# EAGLE board maple-audio-r1 (EAGLE 5.04)
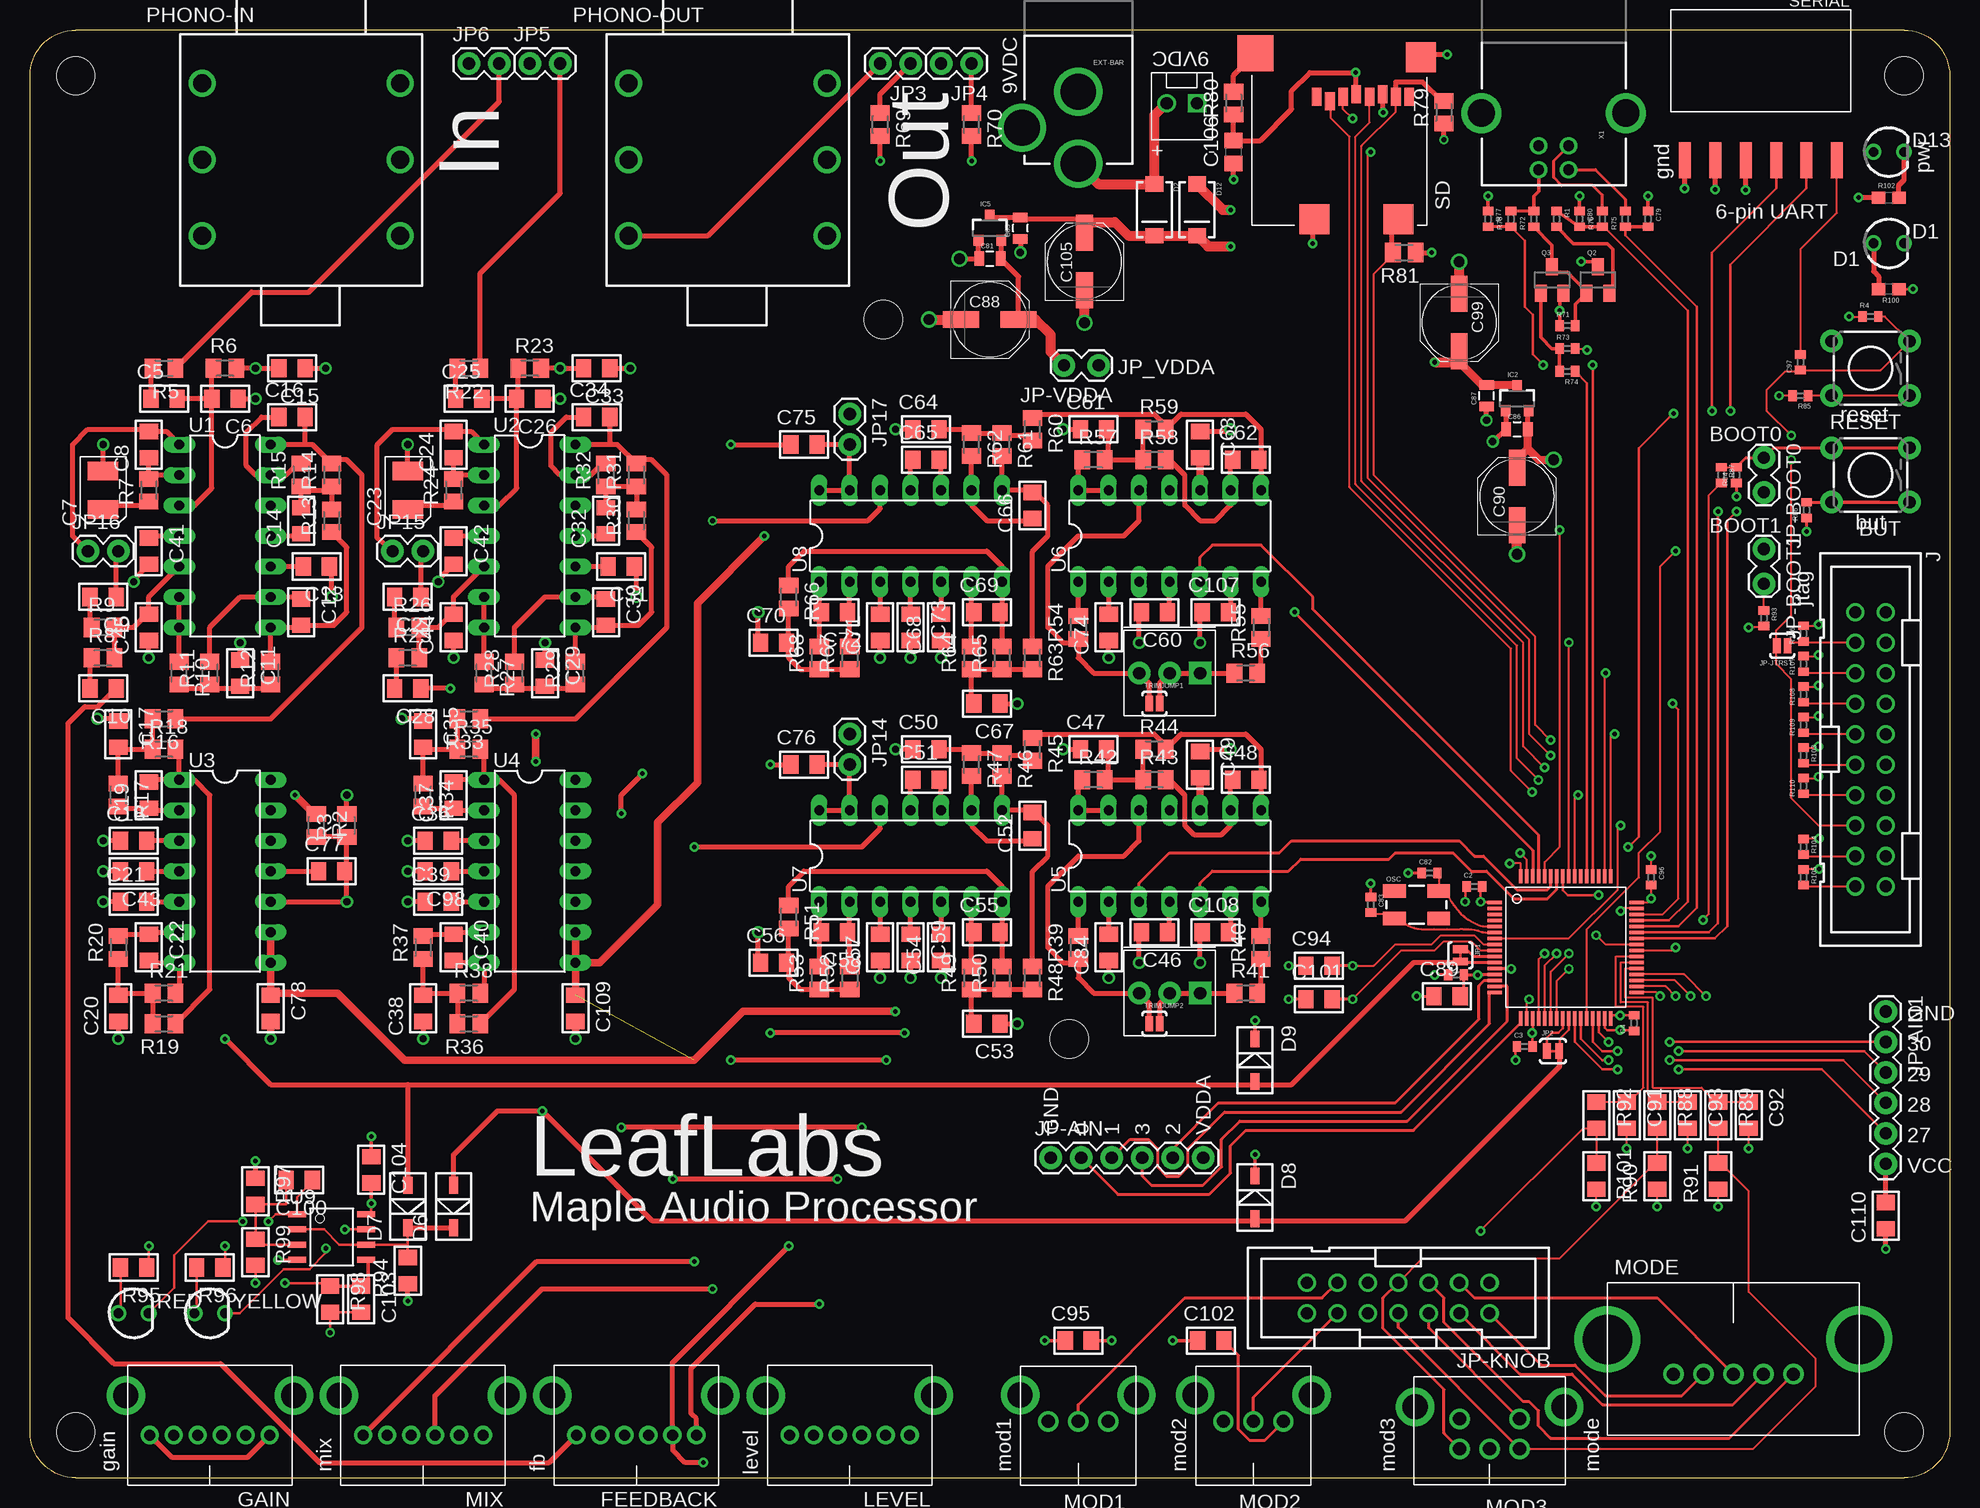
[diagram p4: board, top side]
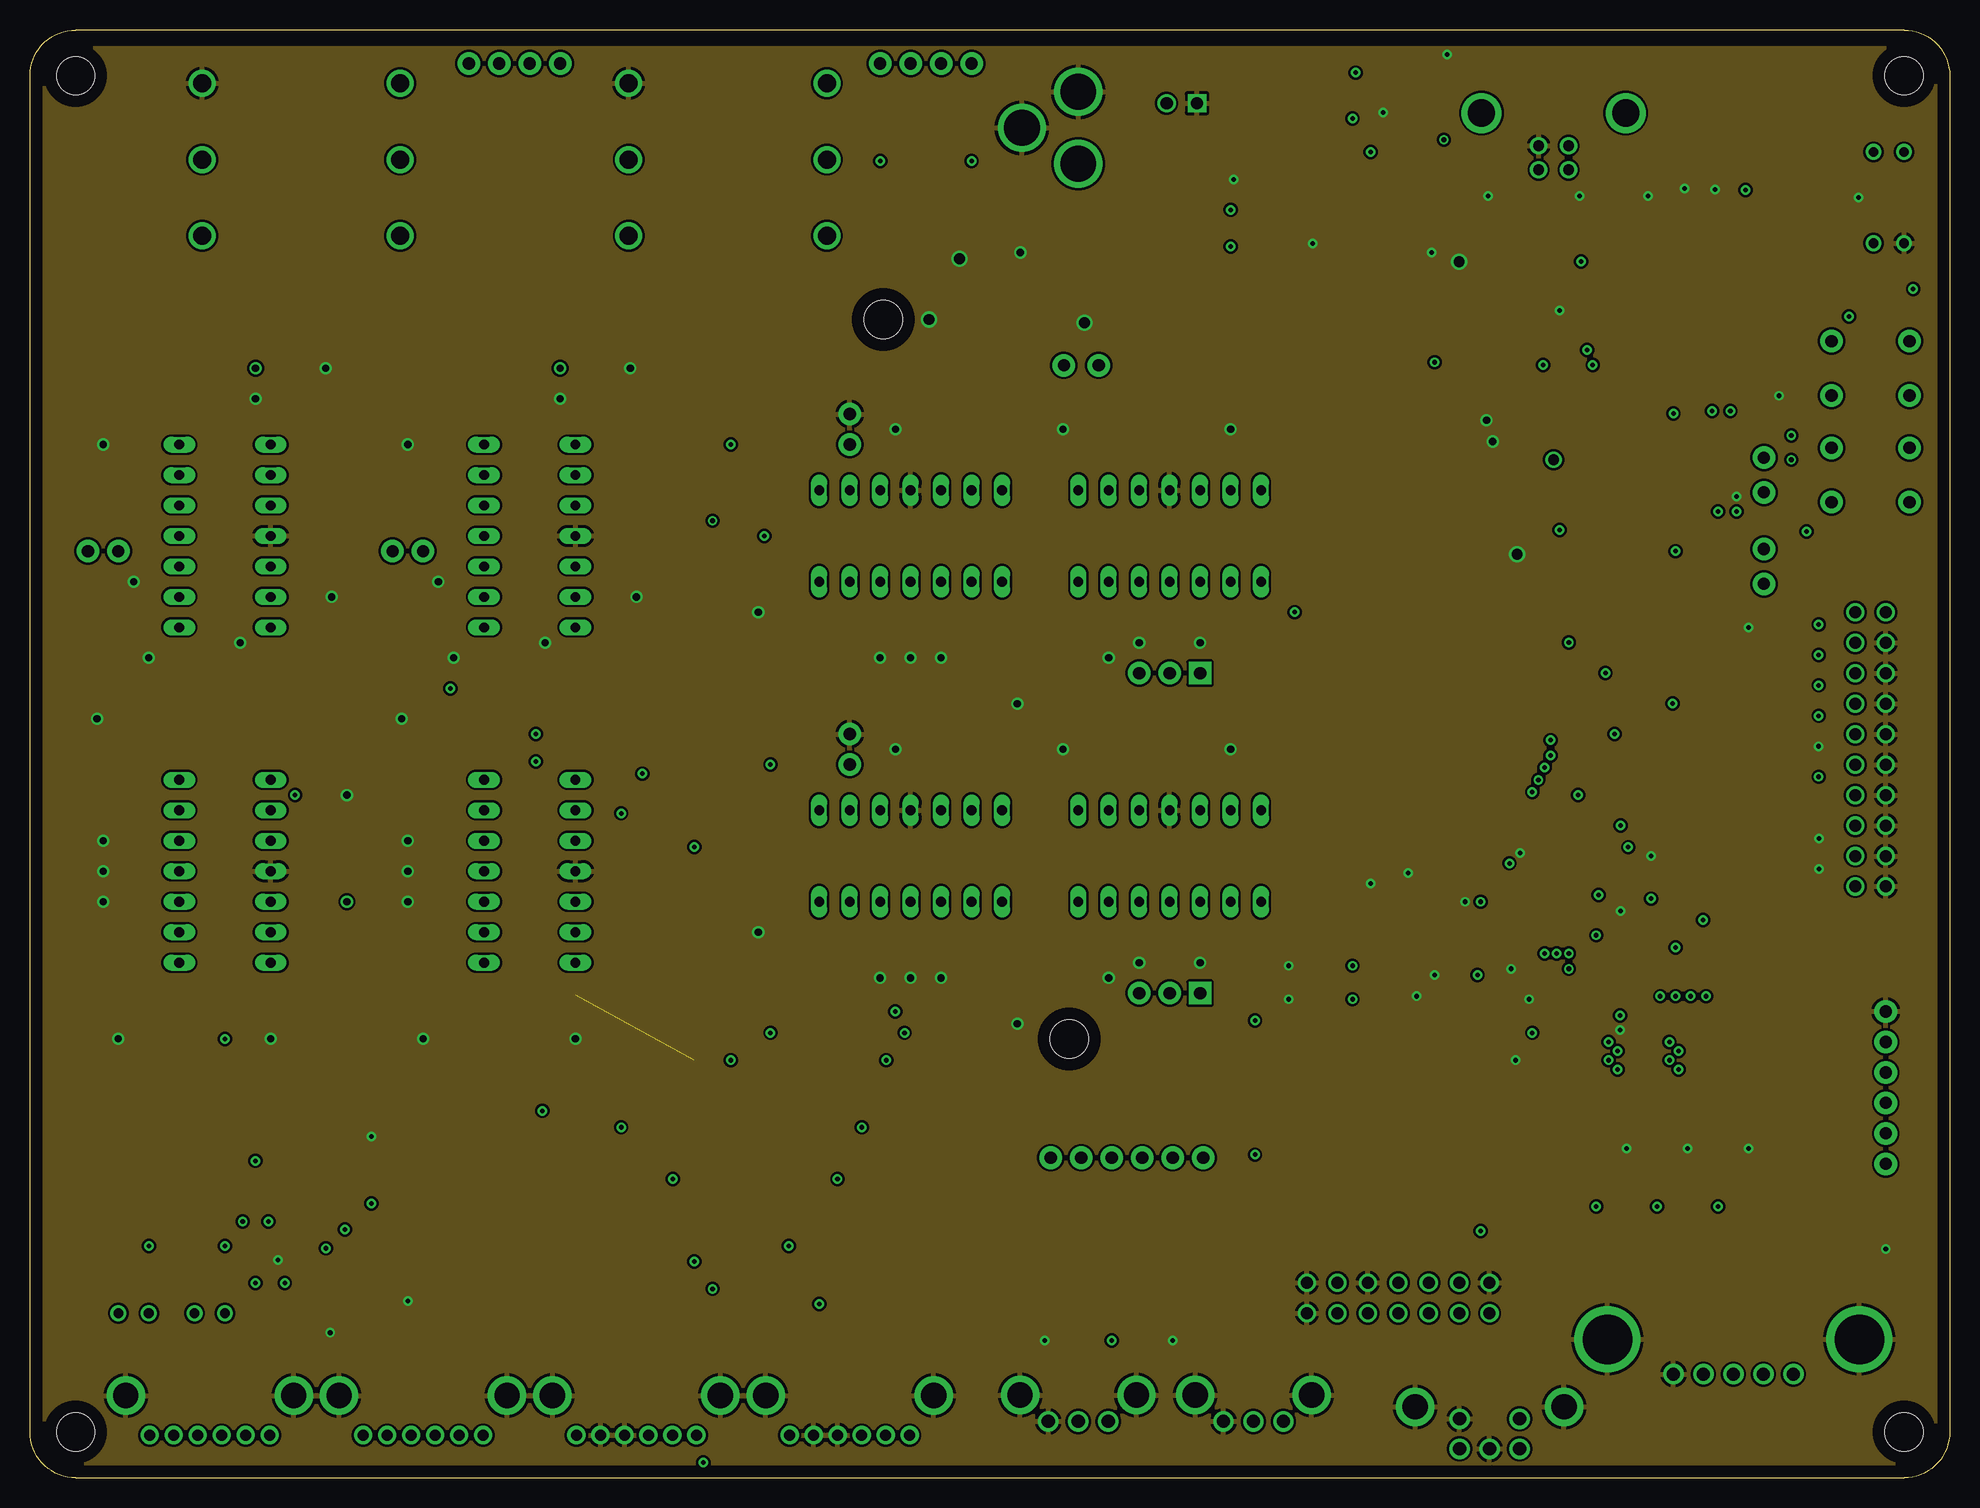
[diagram p5: board, inner layer Route2]
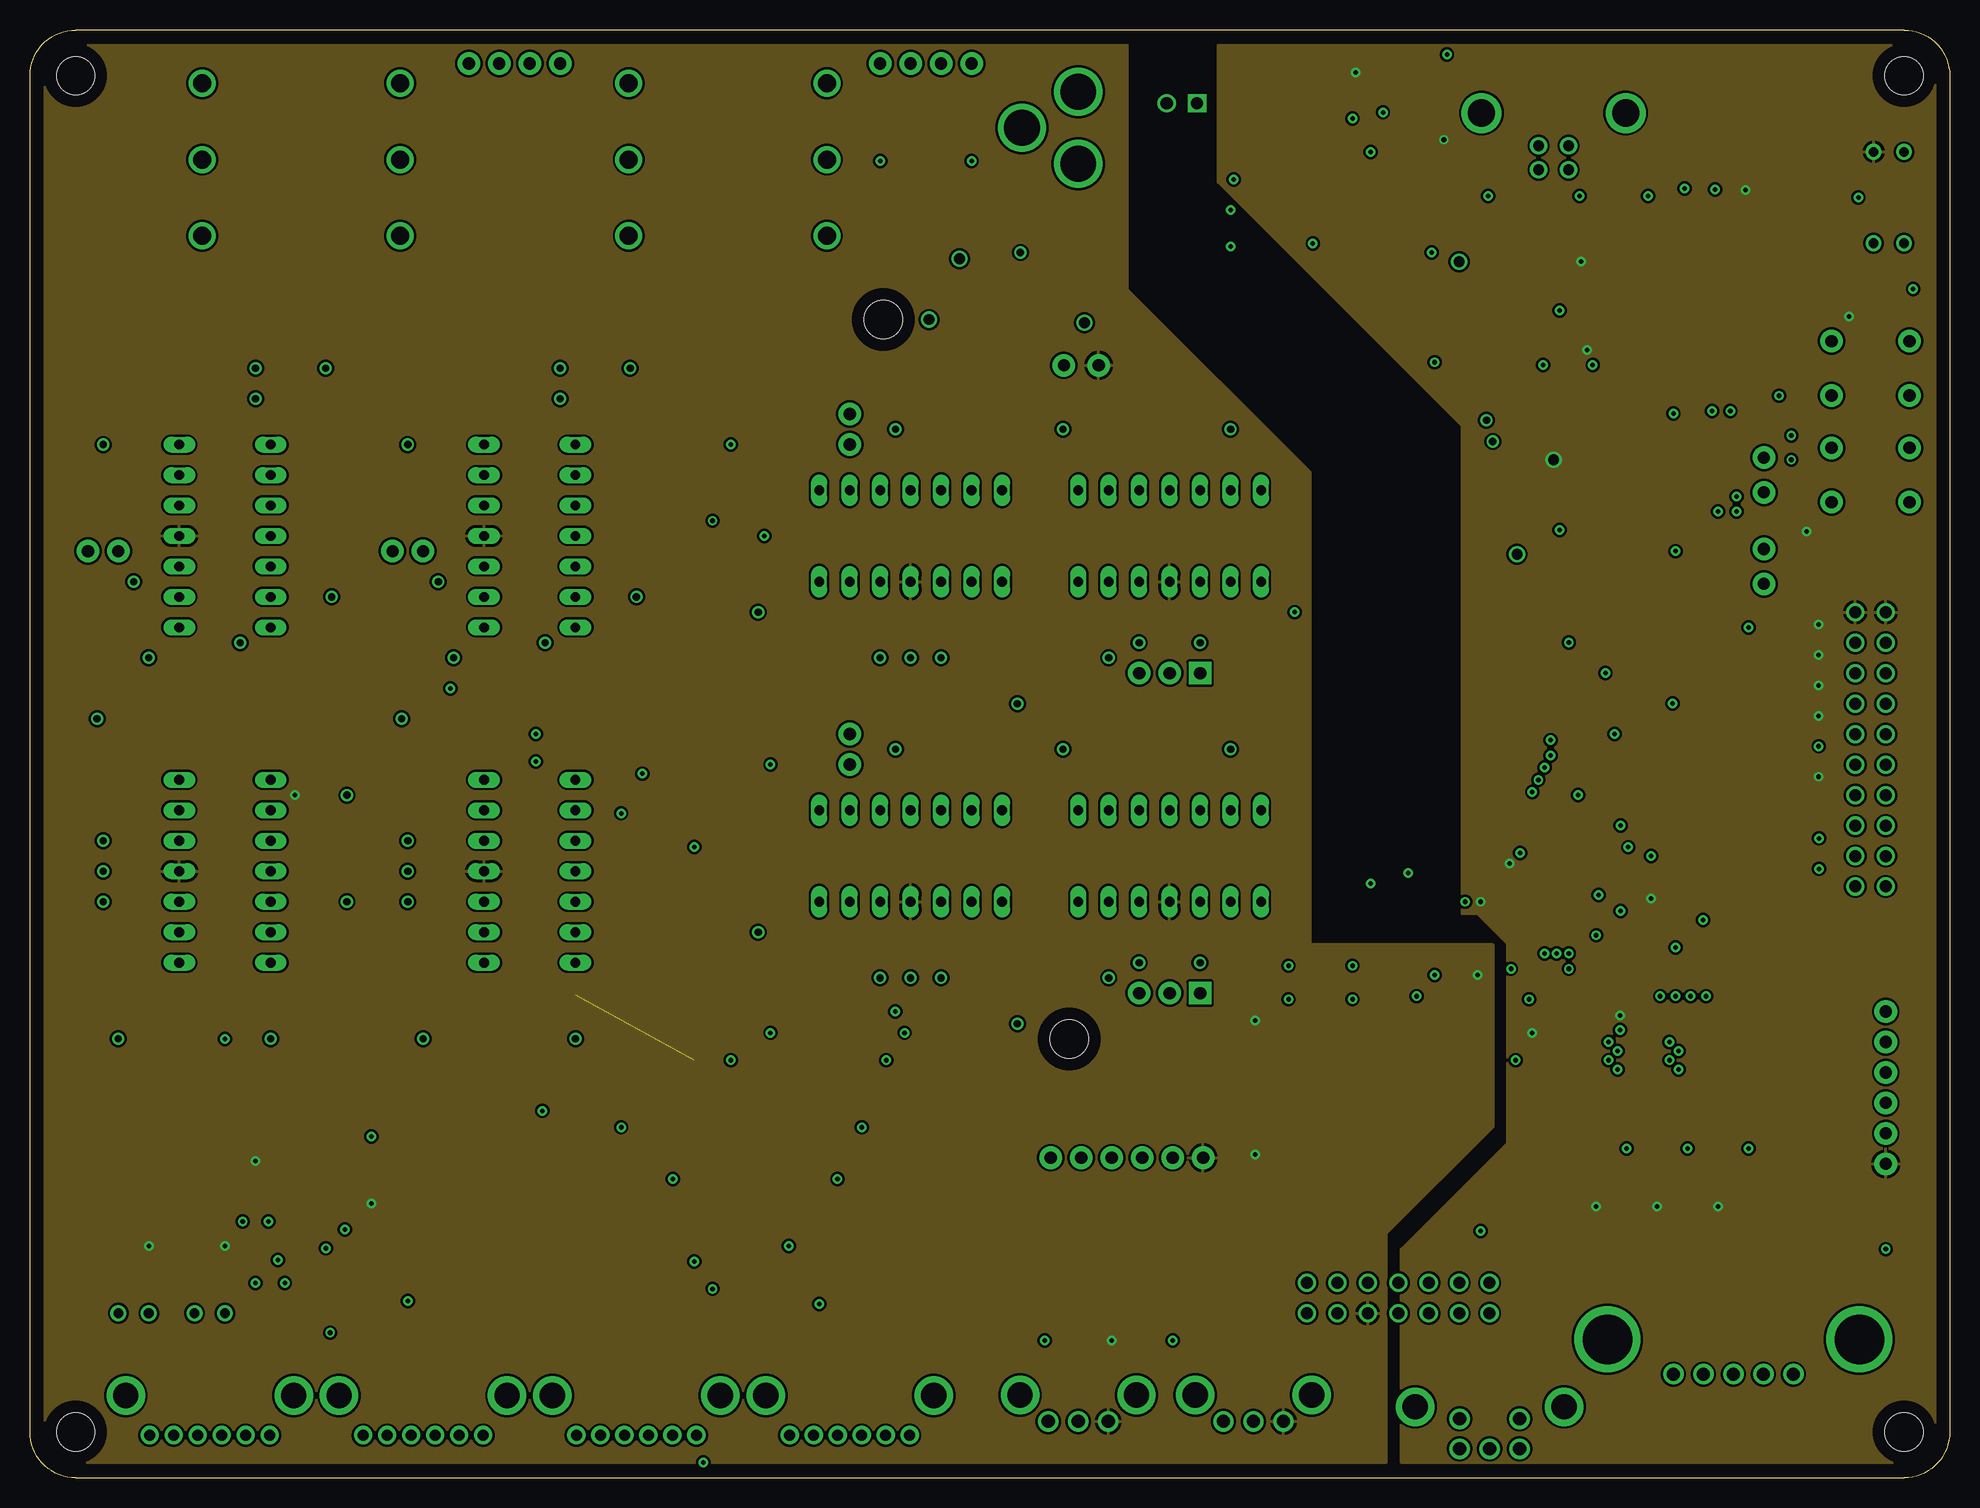
[diagram p6: board, inner layer Route15]
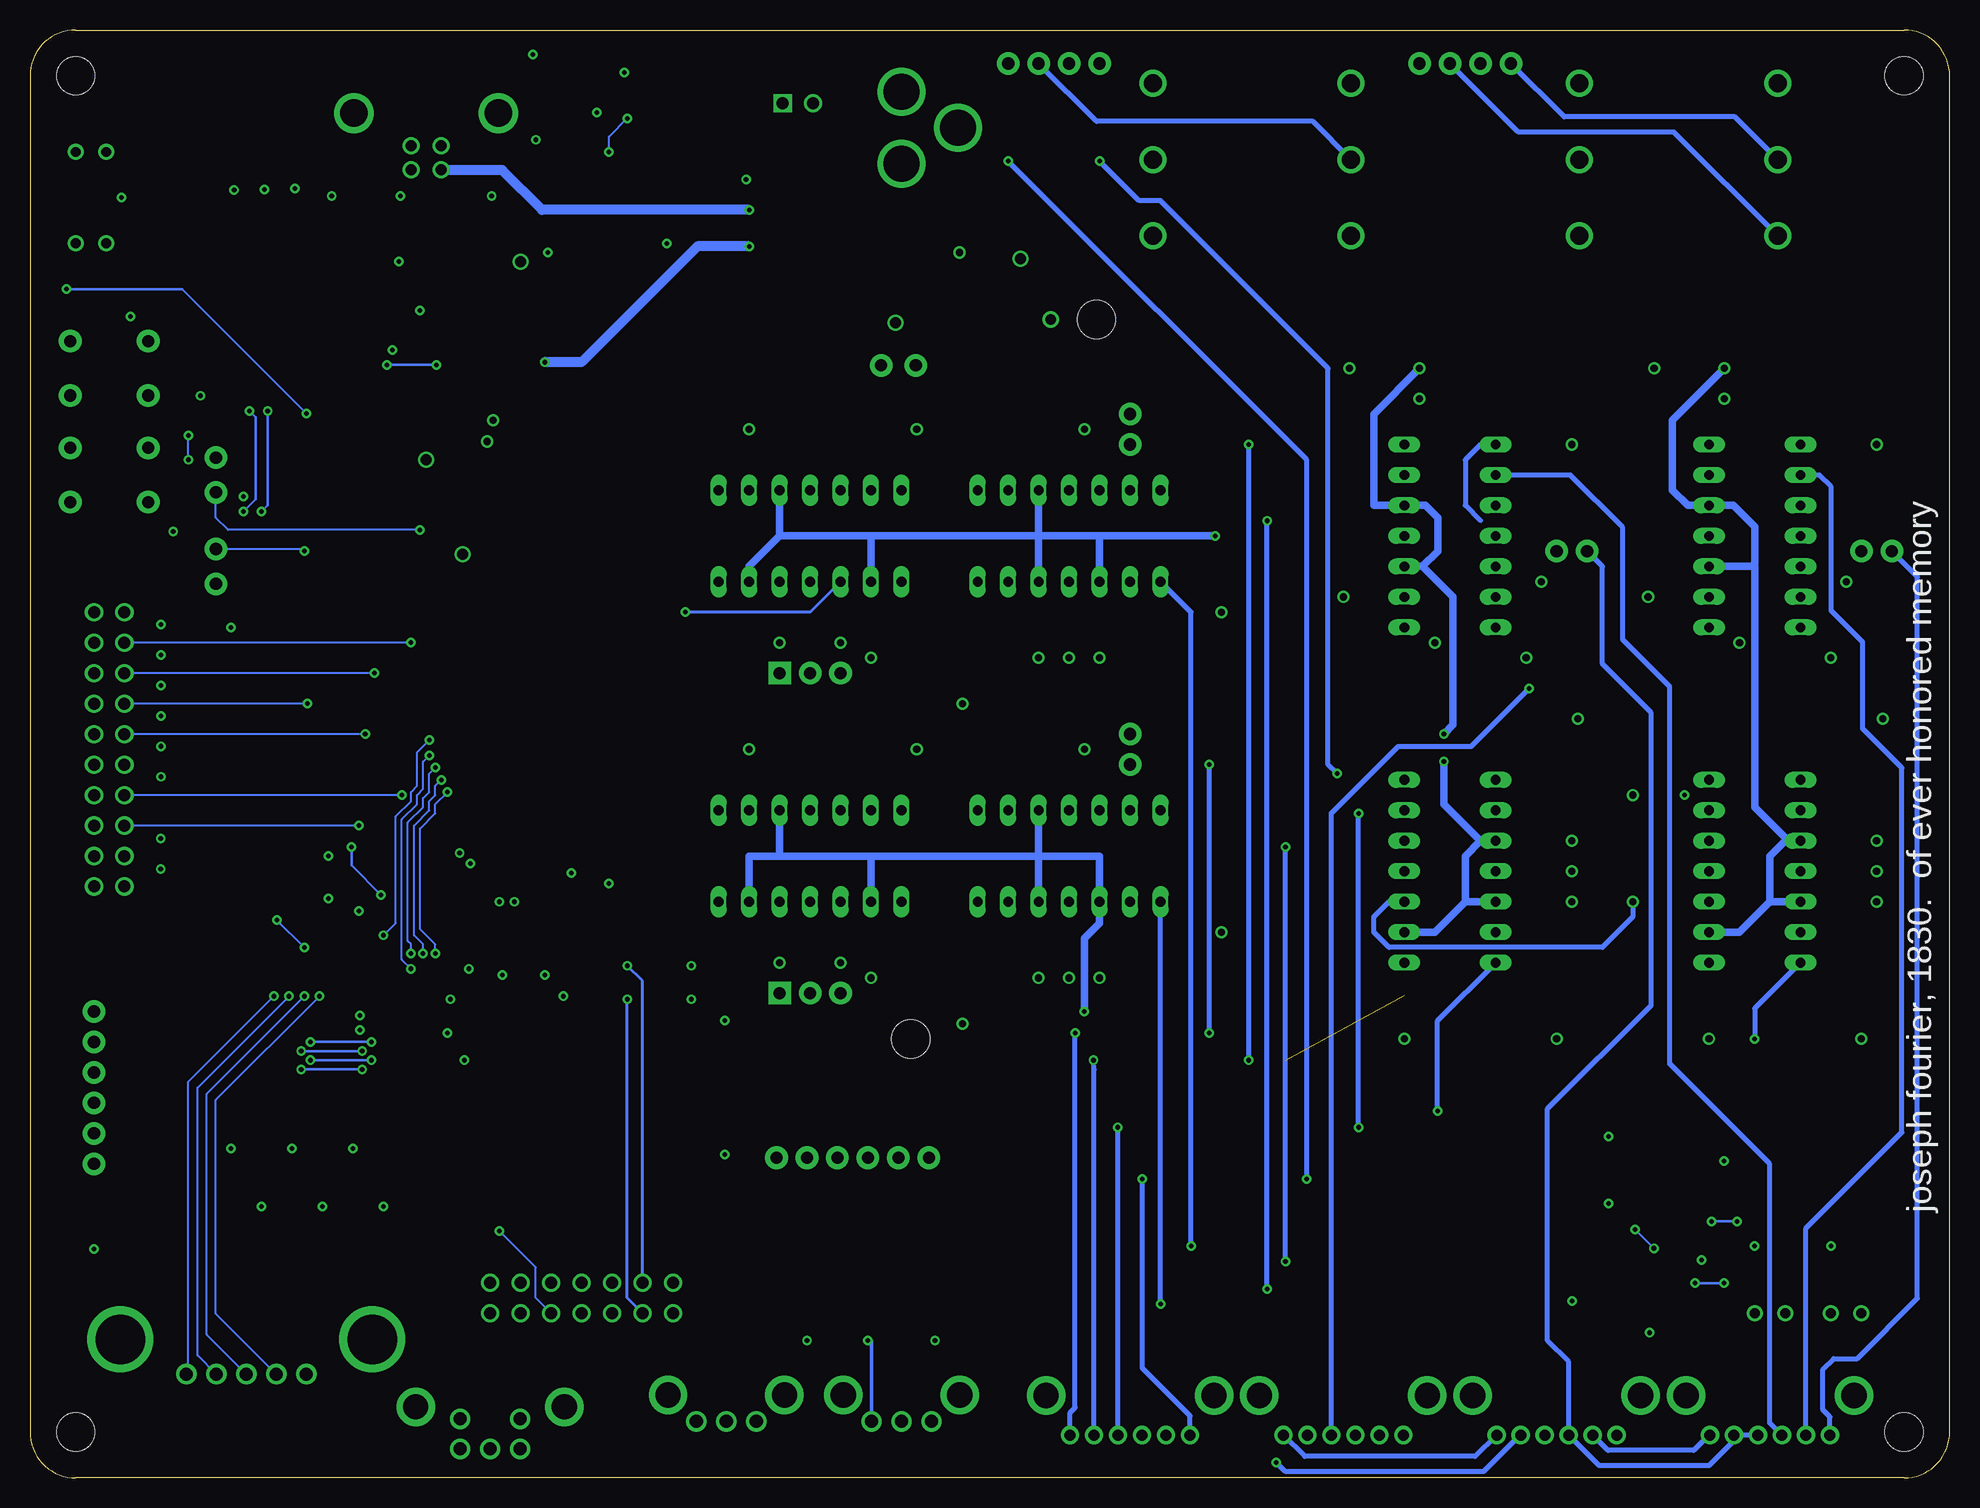
[diagram p7: board, bottom side, seen from below]

Size 160.02 x 120.65 mm. Coordinates in mm from the lower left corner, seen from the top.
Outline: 3.81,0 156.21,0 arc90 160.02,3.81 160.02,116.84 arc90 156.21,120.65 3.81,120.65 arc90 0,116.84 0,3.81 arc90 3.81,0
Copper layers (1*16): Top 0.035mm / dielectric 1.5mm / Bottom 0.035mm
Design rules "default": minimum track width 10mil, minimum drill 24mil, track to track 8mil, track to pad 8mil, pad to pad 8mil, via to via 8mil, smd to smd 8mil, copper to edge 40mil, drill to drill 8mil, minimum pad ring 10mil, minimum via ring 8mil, stop-mask expansion 4mil, vias tented up to drill 0mil, thermal gap 10mil
Net classes: 0 default: width 0.203 mm; 1 power: width 0.203 mm; 2 gnd: width 0.305 mm, drill 0.508 mm, clearance 0.152 mm; 3 usbvcc: width 0.508 mm, drill 0.508 mm, clearance 0.152 mm
Holes 3.17 mm at 3.81,3.81 156.21,3.81 156.21,116.84 3.81,116.84 86.61,36.58 71.12,96.52

## Footprints (pad centres in the part's own frame; a part is rotated, then mirrored left to right if it is on the bottom)
TACTILE-PTH = drill 1.016 pad 1.88 round: 1 -3.251,2.261; 2 3.251,2.261; 3 -3.251,-2.261; 4 3.251,-2.261
C0402 = smd 0.7 x 0.9: 1 -0.65,0; 2 0.65,0
0805A = smd 1.27 x 1.524: + 1.091,0; - -1.091,0
3528-21 = smd 1.524 x 2.54: P$1 -1.6,0; P$2 1.6,0
0805 = smd 0.8 x 1.2: 1 -0.9,0; 2 0.9,0
PANASONIC_D = smd 3 x 1.4: + 2.4,0; - -2.4,0
C0805 = smd 1.3 x 1.5: 1 -0.95,0; 2 0.95,0
LED3MM = drill 0.813 round: A -1.27,0; K 1.27,0
SMA-DIODE = smd 1.27 x 1.47: A -2.15,0; C 2.15,0
SOD-123 = smd 1.397 x 0.762: P$1 -1.778,0; P$2 1.778,0
MOLEX-1X2 = drill 1.016 square: 1 0,0 | drill 1.016 round: 2 2.54,0
POWER_JACK_PTH = drill 2.997 round: GND 0,7.7; GNDBREAK 4.7,10.7; PWR 0,13.7
POT/DUAL/VERT = drill 0.914 pad 1.524 round: P$1 -5,0; P$2 -3,0; P$3 -1,0; P$4 1,0; P$5 3,0; P$6 5,0 | drill 2.108 pad 3.2 round: P$7 -7,-3.3; P$8 7,-3.3
SOT23 = smd 0.8 x 0.9: 1 -0.95,-1; 2 0.95,-1; 3 0,1.1
PAK100/2500-20 = drill 1 pad 1.422 round: 1 -11.43,-1.27; 2 -11.43,1.27; 3 -8.89,-1.27; 4 -8.89,1.27; 5 -6.35,-1.27; 6 -6.35,1.27; 7 -3.81,-1.27; 8 -3.81,1.27; 9 -1.27,-1.27; 10 -1.27,1.27; 11 1.27,-1.27; 12 1.27,1.27; 13 3.81,-1.27; 14 3.81,1.27; 15 6.35,-1.27; 16 6.35,1.27; 17 8.89,-1.27; 18 8.89,1.27; 19 11.43,-1.27; 20 11.43,1.27
SJ_2S-TRACE = smd 0.635 x 1.27: 1 -0.508,0; 2 0.508,0
1X02 = drill 1.016 pad 1.88 round: 1 0,0; 2 2.54,0
1X06 = drill 1.016 pad 1.88 round: 1 0,0; 2 2.54,0; 3 5.08,0; 4 7.62,0; 5 10.16,0; 6 12.7,0
1X02_LOCK = drill 1.016 pad 1.88 round: 1 -0.178,0; 2 2.718,0
SJ_2S-NO = smd 0.635 x 1.27: 1 -0.45,0; 2 0.45,0
PAK100/2500-14 = drill 1 pad 1.422 round: 1 -7.62,-1.27; 2 -7.62,1.27; 3 -5.08,-1.27; 4 -5.08,1.27; 5 -2.54,-1.27; 6 -2.54,1.27; 7 0,-1.27; 8 0,1.27; 9 2.54,-1.27; 10 2.54,1.27; 11 5.08,-1.27; 12 5.08,1.27; 13 7.62,-1.27; 14 7.62,1.27
POT/SINGLE/PANASONIC = drill 1.092 pad 1.7 round: P$1 0,0; P$2 2.5,0; P$3 -2.5,0 | drill 2.108 pad 3.2 round: P$4 -4.85,-2.2; P$5 4.85,-2.2
ROTARY-ENCODER = drill 1.092 pad 1.7 round: P$1 0,0; P$2 -2.5,0; P$3 2.5,0; P$4 2.5,-2.5; P$5 -2.5,-2.5 | drill 2.108 pad 3.2 round: P$6 -6.2,-3.5; P$7 6.2,-3.5
ROTARY-ENCODER/BINARY = drill 1.092 pad 1.7 round: P$1 5,0; P$2 2.5,0; P$3 0,0; P$4 -2.5,0; P$5 -5,0 | drill 4.115 pad 5.5 round: P$6 -10.5,2.9; P$7 10.5,2.9
CRYSTAL-SMD-5X3 = smd 1.9 x 1.1: 1 -1.85,-1.15; 2 1.85,-1.15; 3 1.85,1.15; 4 -1.85,1.15
3362U = drill 1.016 pad 1.88 square: P$1 0,2.54 | drill 1.016 pad 1.88 round: P$2 2.54,2.54; P$3 5.08,2.54
1/4"JACK/STEREO = drill 1.499 round: P$1 -8.255,-4.191; P$2 -8.255,-10.541; P$3 -8.255,-16.891; P$4 8.255,-16.891; P$5 8.255,-10.541; P$6 8.255,-4.191
SOT23' = smd 1 x 1.4: 1 -0.95,-1.1; 2 0.95,-1.1; 3 0,1.1
M0805 = smd 1.3 x 1.6: 1 -0.95,0; 2 0.95,0
0603 = smd 1.1 x 1: 1 -0.85,0; 2 0.85,0
3MMICROSD = smd 0.8 x 1.5: P$1 5.4,10.7; P$2 6.5,10.3; P$3 7.6,10.7; P$4 8.7,10.9; P$5 9.8,10.7; P$6 10.9,10.9; P$7 12,10.7; P$8 13.1,10.7 | smd 3 x 3: P$9 0.3,14.3 | smd 2.5 x 2.5: P$10 12.2,0.5; P$11 5.2,0.5; P$12 14.1,14
1X06-SMD-FEMALE-V2 = smd 1 x 3: 1 6.35,4.5; 2 3.81,4.5; 3 1.27,4.5; 4 -1.27,4.5; 5 -3.81,4.5; 6 -6.35,4.5
14-PDIP = drill 0.813 long: 1 -7.62,-3.81; 2 -5.08,-3.81; 3 -2.54,-3.81; 4 0,-3.81; 5 2.54,-3.81; 6 5.08,-3.81; 7 7.62,-3.81; 8 7.62,3.81; 9 5.08,3.81; 10 2.54,3.81; 11 0,3.81; 12 -2.54,3.81; 13 -5.08,3.81; 14 -7.62,3.81
8-SOIC = smd 1.524 x 0.508: 1 -2.87,1.905; 2 -2.87,0.635; 3 -2.87,-0.635; 4 -2.87,-1.905; 5 2.87,-1.905; 6 2.87,-0.635; 7 2.87,0.635; 8 2.87,1.905
TQFP-10X10-64 = smd 1.2 x 0.3: P$1 -5.936,3.75; P$2 -5.936,3.25; P$3 -5.936,2.75; P$4 -5.936,2.25; P$5 -5.936,1.75; P$6 -5.936,1.25; P$7 -5.936,0.75; P$8 -5.936,0.25; P$9 -5.936,-0.25; P$10 -5.936,-0.75; P$11 -5.936,-1.25; P$12 -5.936,-1.75; P$13 -5.936,-2.25; P$14 -5.936,-2.75; P$15 -5.936,-3.25; P$16 -5.936,-3.75; P$33 5.886,-3.75; P$34 5.886,-3.25; P$35 5.886,-2.75; P$36 5.886,-2.25; P$37 5.886,-1.75; P$38 5.886,-1.25; P$39 5.886,-0.75; P$40 5.886,-0.25; P$41 5.886,0.25; P$42 5.886,0.75; P$43 5.886,1.25; P$44 5.886,1.75; P$45 5.886,2.25; P$46 5.886,2.75; P$47 5.886,3.25; P$48 5.886,3.75 | smd 0.3 x 1.2: P$17 -3.75,-5.911; P$18 -3.25,-5.911; P$19 -2.75,-5.911; P$20 -2.25,-5.911; P$21 -1.75,-5.911; P$22 -1.25,-5.911; P$23 -0.75,-5.911; P$24 -0.25,-5.911; P$25 0.25,-5.911; P$26 0.75,-5.911; P$27 1.25,-5.911; P$28 1.75,-5.911; P$29 2.25,-5.911; P$30 2.75,-5.911; P$31 3.25,-5.911; P$32 3.75,-5.911; P$49 3.75,5.936; P$50 3.25,5.936; P$51 2.75,5.936; P$52 2.25,5.936; P$53 1.75,5.936; P$54 1.25,5.936; P$55 0.75,5.936; P$56 0.25,5.936; P$57 -0.25,5.936; P$58 -0.75,5.936; P$59 -1.25,5.936; P$60 -1.75,5.936; P$61 -2.25,5.936; P$62 -2.75,5.936; P$63 -3.25,5.936; P$64 -3.75,5.936
USB-B-PTH = drill 0.914 round: D+ 0,1.25; D- 1.981,1.25; GND 0,-1.25; VBUS 1.981,-1.25 | drill 2.286 round: P$1 -2.718,-6.02; P$2 -2.718,6.02

## Placement (x,y rotation side)
BUT  [TACTILE-PTH]  153.42,83.57 180 top
C1  0.1uF  [C0402]  118.87,41.91 0 top
C2  1uF  [C0402]  120.4,49.28 0 top
C3  1uF  [C0402]  124.59,35.94 0 top
C4  1uF  [C0402]  133.71,37.9 90 top
C5  0.1uF  [0805A]  11.18,89.92 0 top
C6  220pF  [0805A]  16.26,89.92 180 top
C7  100uF  [3528-21]  6.1,82.3 90 top
C8  100pF  [0805A]  9.91,86.11 90 top
C9  10uF  [0805A]  6.1,73.41 180 top
C10  10uF  [0805A]  6.1,65.79 180 top
C11  2.2nF  [0805A]  17.53,67.06 270 top
C12  1nF  [0805A]  22.61,72.14 270 top
C13  1uF  [0805A]  23.88,75.95 180 top
C14  3.3nF  [0805A]  22.61,79.76 90 top
C15  1uF  [0805A]  21.84,92.46 180 top
C16  1nF  [0805A]  21.84,88.39 0 top
C17  6.8nF  [0805A]  7.37,61.98 270 top
C18  1uF  [0805A]  8.64,53.09 0 top
C19  1nF  [0805A]  9.91,56.9 90 top
C20  47nF  [0805A]  7.37,39.12 90 top
C21  1uF  [0805A]  8.64,48.01 0 top
C22  1nF  [0805A]  9.91,44.2 270 top
C23  100uF  [3528-21]  31.5,82.3 90 top
C24  100pF  [0805A]  35.31,86.11 90 top
C25  0.1uF  [0805A]  36.58,89.92 0 top
C26  220pF  [0805A]  41.66,89.92 180 top
C27  10uF  [0805A]  31.5,73.41 180 top
C28  10uF  [0805A]  31.5,65.79 180 top
C29  2.2nF  [0805A]  42.93,67.06 270 top
C30  1nF  [0805A]  48.01,72.14 270 top
C31  1uF  [0805A]  49.28,75.95 180 top
C32  3.3nF  [0805A]  48.01,79.76 90 top
C33  1uF  [0805A]  47.24,92.46 180 top
C34  1nF  [0805A]  47.24,88.39 0 top
C35  6.8nF  [0805A]  32.77,61.98 270 top
C36  1uF  [0805A]  34.04,53.09 0 top
C37  1nF  [0805A]  35.31,56.9 90 top
C38  47nF  [0805A]  32.77,39.12 90 top
C39  1uF  [0805A]  34.04,48.01 0 top
C40  1nF  [0805A]  35.31,44.2 270 top
C41  10uF  [0805A]  9.91,77.22 270 top
C42  10uF  [0805A]  35.31,77.22 270 top
C43  10uF  [0805A]  8.64,50.55 180 top
C44  220pF  [0805A]  35.31,70.87 90 top
C45  220pF  [0805A]  9.91,70.87 90 top
C46  10uF  [0805A]  93.73,45.47 180 top
C47  2.2nF  [0805A]  88.65,60.71 0 top
C48  1nF  [0805A]  101.35,58.17 0 top
C49  1uF  [0805A]  97.54,59.44 270 top
C50  3.3nF  [0805A]  74.68,60.71 0 top
C51  1uF  [0805A]  74.68,58.17 0 top
C52  1nF  [0805A]  83.57,54.36 90 top
C53  6.8nF  [0805A]  79.76,37.85 180 top
C54  1uF  [0805A]  75.95,44.2 90 top
C55  1nF  [0805A]  79.76,45.47 0 top
C56  47nF  [0805A]  61.98,42.93 0 top
C57  1uF  [0805A]  70.87,44.2 90 top
C58  1nF  [0805A]  67.06,45.47 180 top
C59  10uF  [0805A]  73.41,44.2 270 top
C60  10uF  [0805A]  93.73,72.14 180 top
C61  2.2nF  [0805A]  88.65,87.38 0 top
C62  1nF  [0805A]  101.35,84.84 0 top
C63  1uF  [0805A]  97.54,86.11 270 top
C64  3.3nF  [0805A]  74.68,87.38 0 top
C65  1uF  [0805A]  74.68,84.84 0 top
C66  1nF  [0805A]  83.57,81.03 90 top
C67  6.8nF  [0805A]  79.76,64.52 180 top
C68  1uF  [0805A]  75.95,70.87 90 top
C69  1nF  [0805A]  79.76,72.14 0 top
C70  47nF  [0805A]  61.98,69.6 0 top
C71  1uF  [0805A]  70.87,70.87 90 top
C72  1nF  [0805A]  67.06,72.14 180 top
C73  10uF  [0805A]  73.41,70.87 270 top
C74  1uF  [0805A]  89.92,70.87 90 top
C75  10uF  [0805A]  64.52,86.11 0 top
C76  10uF  [0805A]  64.52,59.44 0 top
C77  10uF  [0805A]  25.15,50.55 0 top
C78  10uF  [0805A]  20.07,39.12 270 top
C79  47pF  [C0402]  134.87,104.9 270 top
C80  47pF  [C0402]  129.16,104.9 270 top
C81  1uF  [0805]  80.01,101.6 0 top
C82  33pF  [C0402]  116.66,50.39 0 top
C83  33pF  [C0402]  111.76,47.75 270 top
C84  1uF  [0805A]  89.92,44.2 90 top
C85  1uF  [0805]  82.55,104.14 90 top
C86  1uF  [0805]  123.95,87.38 0 top
C87  1uF  [0805]  121.41,90.17 90 top
C88  100uF  [PANASONIC_D]  80.01,96.52 0 top
C89  10uF  [0805A]  118.11,40.13 0 top
C90  100uF  [PANASONIC_D]  123.95,81.79 90 top
C91  0.1uF  [0805A]  133.1,30.23 270 top
C92  0.01uF  [0805A]  143.26,30.23 270 top
C93  0.01uF  [0805A]  138.18,30.23 270 top
C94  0.1uF  [0805A]  107.44,42.67 0 top
C95  0.1uF  [0805A]  87.38,11.43 0 top
C96  1uF  [C0402]  135.13,50.04 270 top
C97  0.1uF  [C0402]  147.57,92.96 90 top
C98  10uF  [0805A]  34.04,50.55 180 top
C99  100uF  [PANASONIC_D]  119.13,96.27 270 top
C100  0.1uF  [0805A]  22.45,24.82 180 top
C101  0.1uF  [0805A]  107.44,39.88 0 top
C102  0.1uF  [0805A]  98.42,11.43 0 top
C103  0.1uF  [0805A]  27.61,14.88 270 top
C104  0.1uF  [0805A]  28.45,25.65 270 top
C105  100uF  [PANASONIC_D]  87.88,101.35 90 top
C106  10uF  [C0805]  100.33,110.49 90 top
C107  1uF  [0805A]  98.81,72.14 0 top
C108  1uF  [0805A]  98.81,45.47 0 top
C109  10uF  [0805A]  45.47,39.12 270 top
C110  10uF  [0805A]  154.69,21.84 90 top
D1  Blue  [LED3MM]  154.94,102.87 0 top
D2  [SMA-DIODE]  93.73,105.66 270 top
D6  1N4148  [SOD-123]  35.31,22.61 90 top
D7  1N4148  [SOD-123]  31.5,22.61 90 top
D8  1N4148  [SOD-123]  102.11,23.37 270 top
D9  1N4148  [SOD-123]  102.11,34.8 270 top
D12  [SMA-DIODE]  97.28,105.66 270 top
D13  Green  [LED3MM]  154.94,110.49 0 top
EXT  [MOLEX-1X2]  97.28,114.55 180 top
EXT-BAR  POWER_JACKPTH  [POWER_JACK_PTH]  87.38,123.19 180 top
FEEDBACK  10kB  [POT/DUAL/VERT]  50.55,3.56 180 top
GAIN  50kA  [POT/DUAL/VERT]  14.99,3.56 180 top
IC2  MCP1703T-3302E/CB  [SOT23]  123.95,89.92 0 top
IC5  MCP1703T-5002E/CB  [SOT23]  80.01,104.14 0 top
J  JTAG  [PAK100/2500-20]  153.42,60.71 270 top
JP1  SOLDERJUMPERTRACE  [SJ_2S-TRACE]  119.23,43.54 270 top
JP2  SOLDERJUMPERTRACE  [SJ_2S-TRACE]  126.95,35.56 0 top
JP3  [1X02]  73.41,117.86 180 top
JP4  [1X02]  78.49,117.86 180 top
JP5  [1X02]  41.66,117.86 0 top
JP6  [1X02]  36.58,117.86 0 top
JP14  [1X02]  68.33,61.98 270 top
JP15  [1X02]  30.23,77.22 0 top
JP16  [1X02]  4.83,77.22 0 top
JP17  [1X02]  68.33,88.65 270 top
JP-AIN  [1X06]  85.09,26.67 0 top
JP-AIN1  [1X06]  154.69,38.86 270 top
JP-BOOT0  [1X02_LOCK]  144.53,84.84 270 top
JP-BOOT1  [1X02_LOCK]  144.53,77.22 270 top
JP-JTRST  SOLDERJUMPERNO  [SJ_2S-NO]  146.05,69.34 180 top
JP-KNOB  JP-KNOB  [PAK100/2500-14]  114.05,14.99 180 top
JP-VDDA  [1X02_LOCK]  88.9,92.71 180 top
LEVEL  10kA  [POT/DUAL/VERT]  68.33,3.56 180 top
MIX  50kB  [POT/DUAL/VERT]  32.77,3.56 180 top
MOD1  10kB  [POT/SINGLE/PANASONIC]  87.38,4.7 180 top
MOD2  10kB  [POT/SINGLE/PANASONIC]  101.98,4.7 180 top
MOD3  MOD3  [ROTARY-ENCODER]  121.67,2.41 180 top
MODE  MODE  [ROTARY-ENCODER/BINARY]  141.99,8.64 0 top
OSC  8MHz  [CRYSTAL-SMD-5X3]  115.57,47.75 0 top
OTRIM1  [3362U]  97.54,69.6 180 top
OTRIM2  [3362U]  97.54,42.93 180 top
PHONO-IN  IN  [1/4"JACK/STEREO]  22.61,120.4 0 top
PHONO-OUT  IN  [1/4"JACK/STEREO]  58.17,120.4 0 top
Q2  [SOT23']  130.68,99.82 0 top
Q3  [SOT23']  126.87,99.82 0 top
R1  1.5k  [C0402]  127.25,104.9 270 top
R2  10k  [M0805]  23.88,54.36 270 top
R3  10k  [M0805]  26.42,54.36 90 top
R4  10k  [C0402]  153.42,96.77 0 top
R5  10k  [M0805]  11.18,92.46 180 top
R6  100k  [M0805]  16.26,92.46 0 top
R7  1k  [M0805]  9.91,82.3 90 top
R8  33k  [M0805]  6.1,68.33 0 top
R9  33k  [M0805]  6.1,70.87 0 top
R10  6.2k  [M0805]  12.45,67.06 270 top
R11  4.7k  [M0805]  14.99,67.06 90 top
R12  6.2k  [M0805]  20.07,67.06 90 top
R13  4.3k  [M0805]  25.15,79.76 90 top
R14  4.3k  [M0805]  25.15,83.57 90 top
R15  4.3k  [M0805]  22.61,83.57 90 top
R16  3.6k  [M0805]  11.18,63.25 180 top
R17  2.7k  [M0805]  7.37,56.9 270 top
R18  3.6k  [M0805]  11.18,60.71 0 top
R19  1.6k  [M0805]  11.18,37.85 180 top
R20  820  [M0805]  7.37,44.2 90 top
R21  1.6k  [M0805]  11.18,40.39 0 top
R22  10k  [M0805]  36.58,92.46 180 top
R23  100k  [M0805]  41.66,92.46 0 top
R24  1k  [M0805]  35.31,82.3 90 top
R25  33k  [M0805]  31.5,68.33 0 top
R26  33k  [M0805]  31.5,70.87 0 top
R27  6.2k  [M0805]  37.85,67.06 270 top
R28  4.7k  [M0805]  40.39,67.06 90 top
R29  6.2k  [M0805]  45.47,67.06 90 top
R30  4.3k  [M0805]  50.55,79.76 90 top
R31  4.3k  [M0805]  50.55,83.57 90 top
R32  4.3k  [M0805]  48.01,83.57 90 top
R33  3.6k  [M0805]  36.58,63.25 180 top
R34  2.7k  [M0805]  32.77,56.9 270 top
R35  3.6k  [M0805]  36.58,60.71 0 top
R36  1.6k  [M0805]  36.58,37.85 180 top
R37  820  [M0805]  32.77,44.2 90 top
R38  1.6k  [M0805]  36.58,40.39 0 top
R39  100  [M0805]  87.38,44.2 90 top
R40  25.5k  [M0805]  102.62,44.2 90 top
R41  100  [M0805]  101.35,40.39 0 top
R42  6.2k  [M0805]  88.65,58.17 0 top
R43  4.7k  [M0805]  93.73,58.17 0 top
R44  6.2k  [M0805]  93.73,60.71 0 top
R45  4.3k  [M0805]  83.57,60.71 270 top
R46  4.3k  [M0805]  81.03,59.44 270 top
R47  4.3k  [M0805]  78.49,59.44 270 top
R48  3.6k  [M0805]  83.57,41.66 270 top
R49  2.7k  [M0805]  78.49,41.66 90 top
R50  3.6k  [M0805]  81.03,41.66 90 top
R51  1.6k  [M0805]  63.25,46.74 270 top
R52  820  [M0805]  68.33,41.66 90 top
R53  1.6k  [M0805]  65.79,41.66 90 top
R54  100  [M0805]  87.38,70.87 90 top
R55  25.5k  [M0805]  102.62,70.87 90 top
R56  100  [M0805]  101.35,67.06 0 top
R57  6.2k  [M0805]  88.65,84.84 0 top
R58  4.7k  [M0805]  93.73,84.84 0 top
R59  6.2k  [M0805]  93.73,87.38 0 top
R60  4.3k  [M0805]  83.57,87.38 270 top
R61  4.3k  [M0805]  81.03,86.11 270 top
R62  4.3k  [M0805]  78.49,86.11 270 top
R63  3.6k  [M0805]  83.57,68.33 270 top
R64  2.7k  [M0805]  78.49,68.33 90 top
R65  3.6k  [M0805]  81.03,68.33 90 top
R66  1.6k  [M0805]  63.25,73.41 270 top
R67  820  [M0805]  68.33,68.33 90 top
R68  1.6k  [M0805]  65.79,68.33 90 top
R69  10k  [M0805]  70.87,112.78 270 top
R70  10k  [M0805]  78.49,112.78 270 top
R71  36k  [C0402]  128.14,96.01 0 top
R72  10k  [C0402]  125.35,104.9 90 top
R73  47k  [C0402]  128.14,94.11 0 top
R74  1k  [C0402]  128.14,92.2 180 top
R75  22  [C0402]  132.97,104.9 90 top
R76  22  [C0402]  131.06,104.9 90 top
R77  1.5k  [C0402]  121.54,104.9 270 top
R78  1.5k  [C0402]  123.44,104.9 90 top
R79  10k  [M0805]  117.86,113.79 90 top
R80  2k  [M0805]  100.33,114.55 90 top
R81  33k  [M0805]  114.55,102.11 180 top
R84  10k  [C0402]  142.24,83.57 90 top
R85  1k  [C0402]  147.57,90.17 180 top
R86  1k  [C0402]  148.08,80.64 90 top
R87  1k  [C0402]  140.97,83.57 270 top
R88  10k  [0805A]  135.64,30.23 270 top
R89  10k  [0805A]  140.72,30.23 270 top
R90  10k  [0805A]  135.64,25.15 90 top
R91  10k  [0805A]  140.72,25.15 90 top
R92  1k  [0805A]  130.56,30.23 270 top
R93  10k  [C0402]  144.53,71.63 270 top
R94  510k  [0805A]  31.5,17.27 90 top
R95  1k  [0805A]  8.64,17.53 180 top
R96  1k  [0805A]  14.99,17.53 180 top
R97  348k  [0805A]  18.8,23.88 270 top
R98  510k  [0805A]  25.02,14.88 270 top
R99  348k  [0805A]  18.8,18.8 270 top
R100  1k  [0603]  154.94,99.06 180 top
R101  10k  [0805A]  130.56,25.15 270 top
R102  1k  [0603]  154.94,106.68 0 top
R103  10k  [C0402]  147.83,60.2 270 top
R104  10k  [C0402]  147.83,52.58 270 top
R105  10k  [C0402]  147.83,50.04 270 top
R106  10k  [C0402]  147.83,70.36 90 top
R107  10k  [C0402]  147.83,67.82 90 top
R108  10k  [C0402]  147.83,65.28 90 top
R109  10k  [C0402]  147.83,62.74 90 top
R110  10k  [C0402]  147.83,57.66 90 top
RED  LED3MM  [LED3MM]  8.64,13.72 0 top
RESET  [TACTILE-PTH]  153.42,92.46 180 top
SD  3MMICROSD  [3MMICROSD]  101.85,104.39 0 top
SERIAL  [1X06-SMD-FEMALE-V2]  144.27,114.3 180 top
TRIMJUMP1  SOLDERJUMPERNO  [SJ_2S-NO]  93.73,64.52 0 top
TRIMJUMP2  SOLDERJUMPERNO  [SJ_2S-NO]  93.73,37.85 0 top
U1  TLV274  [14-PDIP]  16.26,78.49 270 top
U2  TLV274  [14-PDIP]  41.66,78.49 270 top
U3  TLV274  [14-PDIP]  16.26,50.55 270 top
U4  TLV274  [14-PDIP]  41.66,50.55 270 top
U5  TLV274  [14-PDIP]  95,51.82 0 top
U6  TLV274  [14-PDIP]  95,78.49 0 top
U7  TLV274  [14-PDIP]  73.41,51.82 0 top
U8  TLV274  [14-PDIP]  73.41,78.49 0 top
U9  LM393  [8-SOIC]  25.15,20.07 0 top
UC1  STM32F103  [TQFP-10X10-64]  128.02,44.2 0 top
X1  USBPTH  [USB-B-PTH]  127,111 270 top
YELLOW  LED3MM  [LED3MM]  14.99,13.72 0 top

## Tracks (layer width: path | path; a pad name or v marks a point on that pad's centre or on a via)
0
  Top 0.254: UC1.P$17 124.27,37.91 115.32,28.96 101.35,28.96 100.08,27.69 100.08,25.4 98.3,23.62 90.68,23.62 JP-AIN.2
1
  Top 0.254: UC1.P$16 121.61,40.45 121.67,40.4 121.67,37.85 114.3,30.48 99.57,30.48 96.52,27.43 96.52,25.91 95.76,25.15 94.74,25.15 93.98,25.91 93.98,27.43 93.22,28.19 91.69,28.19 JP-AIN.3
2
  Top 0.254: UC1.P$14 121.23,41.45 120.78,41 120.78,38.23 113.79,31.24 99.06,31.24 95.25,27.43 JP-AIN.5
3
  Top 0.254: UC1.P$15 123.14,40.95 123.14,38.05 114.81,29.72 100.84,29.72 99.31,28.19 99.31,25.91 97.79,24.38 93.47,24.38 92.71,25.15 JP-AIN.4
4  (via drill 0.38)
  Top 0.203: UC1.P$57 127.77,48.97 128.17,48.56 v130.76,48.56 | v133.22,52.55 134.09,53.42 134.09,85.8 v136.98,88.7 | v156.97,99.06 R100.1
  Bottom 0.203: v130.76,48.56 133.22,51.03 v133.22,52.55 | v136.98,88.7 147.34,99.06 v156.97,99.06
5
  Top 0.254: UC1.P$58 127.27,49.03 126.49,48.26 123.7,48.26 121.41,50.55 120.14,50.55 118.62,52.07 113.79,52.07 113.28,51.56 105.92,51.56 104.9,50.55 98.55,50.55 97.54,49.53 U5.5
6  (via drill 0.38)
  Top 0.152: UC1.P$41 131.32,44.45 v130.56,45.21 | v126.75,61.47 125.48,62.74 125.48,70.1 112.01,83.57 112.01,100.33 113.28,101.6 113.28,101.79 R81.2
  Top 0.406: R81.2 113.54,102.17 113.54,104.65 113.78,104.89 SD.P$10
  Bottom 0.152: v130.56,45.21 129.54,46.23 129.54,55.12 128.27,56.39 128.27,57.15 127.76,57.66 127.76,60.45 v126.75,61.47
7  (via drill 0.38)
  Top 0.203: UC1.P$42 140.45,44.95 141.48,45.97 141.48,79.76 v142.24,80.52 | v141.73,88.9 141.73,101.09 148.08,107.44 SERIAL.5
  Bottom 0.203: v142.24,80.52 141.22,81.53 141.22,88.39 v141.73,88.9
8  (via drill 0.38)
  Top 0.203: UC1.P$43 139.92,45.45 140.69,46.22 140.69,80.49 v140.72,80.52 | v140.21,88.9 140.21,102.11 145.54,107.44 SERIAL.4
  Bottom 0.203: v140.72,80.52 140.21,81.03 v140.21,88.9
9
  Top 0.254: UC1.P$59 126.77,49.3 126.49,49.02 123.95,49.02 121.16,51.82 120.4,51.82 119.13,53.09 105.16,53.09 104.14,52.07 95,52.07 92.46,49.53 U5.3
10  (via drill 0.38)
  Top 0.152: UC1.P$20 125.77,43.22 v126.24,43.69 | v125.22,57.15 123.44,58.93 123.44,69.09 109.98,82.55 109.98,111.76 108.46,113.28 108.46,114.59 SD.P$2
  Bottom 0.152: v126.24,43.69 126.24,44.45 127.51,45.72 127.51,54.1 126.24,55.37 126.24,56.13 v125.22,57.15
11  (via drill 0.38)
  Top 0.152: UC1.P$23 127.27,41.41 v128.27,42.42 | v126.75,60.2 124.97,61.98 124.97,69.85 111.51,83.31 111.51,110.24 v111.76,110.49 | v110.24,113.28 109.45,114.07 SD.P$3
  Bottom 0.152: v128.27,42.42 129.03,43.18 129.03,54.86 127.76,56.13 127.76,56.9 127.25,57.4 127.25,59.69 v126.75,60.2 | v111.76,110.49 111.76,111.76 v110.24,113.28
12  (via drill 0.38)
  Top 0.152: UC1.P$22 126.77,42.18 v128.27,43.69 | v126.24,59.18 124.46,60.96 124.46,69.6 111,83.06 111,111 113.85,113.85 SD.P$7
  Top 0.406: R79.2 117.67,114.74 116.08,116.33 113.85,116.33 SD.P$7
  Bottom 0.152: v128.27,43.69 128.27,44.45 128.52,44.7 128.52,54.61 127.25,55.88 127.25,56.64 126.75,57.15 126.75,58.67 v126.24,59.18
13  (via drill 0.38)
  Top 0.152: UC1.P$21 126.27,42.7 v127.25,43.69 | v125.73,58.17 123.95,59.94 123.95,69.34 110.49,82.8 110.49,111.76 111.65,112.92 SD.P$5
  Bottom 0.152: v127.25,43.69 127.25,44.45 128.02,45.21 128.02,54.36 126.75,55.63 126.75,56.39 126.24,56.9 126.24,57.66 v125.73,58.17
14
  Top 0.254: U6.5 97.54,76.71 98.55,77.72 102.62,77.72 106.93,73.41 106.93,72.39 125.77,53.56 UC1.P$61
15  (via drill 0.38)
  Top 0.152: UC1.P$8 121.16,44.45 120.4,45.21 117.6,45.21 116.84,44.45 113.79,44.45 112.01,42.67 v110.24,42.67
  Top 0.254: JP-KNOB.11 107.7,14.99 96.27,14.99 87.38,6.1 MOD1.P$1 | v110.24,42.67 C94.+
  Bottom 0.254: JP-KNOB.11 108.97,38.61 108.97,41.4 v110.24,42.67
16  (via drill 0.38)
  Top 0.152: UC1.P$9 120.9,43.95 120.14,44.7 117.86,44.7 117.09,43.94 114.3,43.94 v110.24,39.88
  Top 0.254: MOD2.P$1 101.98,6.73 JP-KNOB.12 | v110.24,39.88 C101.+
  Bottom 0.254: v110.24,39.88 110.24,14.99 JP-KNOB.12
17
  Top 0.254: UC1.P$10 120.31,43.45 119.71,44.04 JP1.1
18  (via drill 0.38)
  Top 0.254: UC1.P$11 119.23,42.95 JP1.2 | 101.98,32.77 D9.P$2
  Top 0.406: R21.2 12.45,40.39 U3.7 9.91,42.93 C22.+ | 119.23,42.95 115.34,42.95 105.16,32.77 101.98,32.77 31.5,32.77 | 31.5,32.77 20.07,32.77 v16.26,36.58 | 31.5,32.77 D7.P$2
  Bottom 0.406: v16.26,36.58 16.26,39.12 U3.7
19
  Top 0.203: 126.49,35.87 JP2.1 126.44,36.65 126.87,37.08 127.38,37.08 127.77,37.47 UC1.P$24
20  (via drill 0.38)
  Top 0.203: UC1.P$25 128.27,37.33 127.51,36.58 127.51,35.61 JP2.2
  Top 0.254: 101.98,21.44 D8.P$2
  Top 0.406: C40.+ 35.31,42.93 U4.7 37.85,40.39 R38.2 | D6.P$2 35.31,26.92 38.96,30.58 v42.7,30.58 51.84,21.44 101.98,21.44 114.66,21.44 127.51,34.29 127.51,35.51 JP2.2
  Bottom 0.406: v42.7,30.58 42.7,38.08 U4.7
24  (via drill 0.38)
  Top 0.254: UC1.P$62 125.27,52.28 v105.41,72.14
  Bottom 0.254: v105.41,72.14 95,72.14 U6.3
27  (via drill 0.38)
  Top 0.203: UC1.P$26 128.77,36.33 131.06,34.04 v132.33,34.04 | v137.41,34.04 149.35,34.04 JP-AIN1.5
  Bottom 0.203: v132.33,34.04 v137.41,34.04
28  (via drill 0.38)
  Top 0.203: UC1.P$27 129.27,36.6 131.06,34.8 v131.57,34.8 | v136.65,34.8 151.13,34.8 JP-AIN1.4
  Bottom 0.203: v131.57,34.8 v136.65,34.8
29  (via drill 0.38)
  Top 0.203: v137.41,35.56 152.91,35.56 JP-AIN1.3 | UC1.P$29 130.27,36.36 131.06,35.56 v132.33,35.56
  Bottom 0.203: v132.33,35.56 v137.41,35.56
30  (via drill 0.38)
  Top 0.203: UC1.P$30 130.77,37.13 v131.57,36.32 | v136.65,36.32 JP-AIN1.2
  Bottom 0.203: v131.57,36.32 v136.65,36.32
31  (via drill 0.38)
  Top 0.152: UC1.P$33 135.58,40.45 v135.89,40.13
  Top 0.254: MODE.P$4 137.71,6.86 131.32,6.86 128.78,9.4 125.98,9.4 JP-KNOB.2
  Bottom 0.152: v135.89,40.13 144.53,31.5 144.53,13.68 MODE.P$4
32  (via drill 0.38)
  Top 0.152: UC1.P$34 136.35,40.95 v137.16,40.13
  Top 0.254: MODE.P$3 135.64,14.99 120.4,14.99 JP-KNOB.3
  Bottom 0.152: v137.16,40.13 145.29,32 145.29,11.94 MODE.P$3
33  (via drill 0.38)
  Top 0.152: UC1.P$35 137.12,41.45 v138.43,40.13
  Top 0.254: JP-KNOB.4 124.21,8.64 128.52,8.64 131.06,6.1 141.95,6.1 MODE.P$2
  Bottom 0.152: v138.43,40.13 146.05,32.51 146.05,10.2 MODE.P$2
34  (via drill 0.38)
  Top 0.152: UC1.P$36 137.89,41.95 v139.7,40.13
  Top 0.254: MODE.P$1 141.65,3.3 126.75,3.3 125.73,4.32 125.73,5.59 124.97,6.35 124.46,6.35 117.86,12.95 117.86,14.99 JP-KNOB.5
  Bottom 0.152: v139.7,40.13 146.81,33.02 146.81,8.81 MODE.P$1
35
  Top 0.152: R89.- 140.97,31.57 | R89.- C92.- | UC1.P$37 132.97,42.45 132.97,40.01 135.25,40.01 135.25,32.51 139.32,32.51 139.95,31.88 140.16,31.88 R89.-
36
  Top 0.152: C93.- R88.- 135.2,31.75 135.13,31.75 134.87,32 134.87,39.62 132.59,39.62 132.59,42.95 UC1.P$38
37
  Top 0.152: R92.- C91.- 133.6,31.82 133.81,31.82 134.49,32.51 134.49,39.24 132.21,39.24 132.21,43.45 UC1.P$39
38  (via drill 0.38)
  Top 0.152: v139.45,46.48 139.95,46.99 139.95,81.9 R87.2 | v137.16,44.2 136.91,43.95 UC1.P$40
  Bottom 0.152: v137.16,44.2 v139.45,46.48
+5V  (via drill 0.38)
  Top 0.254: R72.2 R78.2
  Top 0.305: R72.2 125.35,106.81 125.75,107.21 X1.VBUS
  Top 0.813: D12.A 99.43,105.66 v100.08,105.66
  Bottom 0.813: 125.73,109.22 125.73,109.04 X1.VBUS 125.7,108.97 120.65,108.97 117.35,105.66 v100.08,105.66
BOOT0
  Top 0.152: R87.1 R84.2
  Top 0.254: R84.2 143.04,85.01 JP-BOOT0.1 145.34,85.83 BUT.4 BUT.3
BOOT1  (via drill 0.38)
  Top 0.152: UC1.P$28 129.77,45.69 134.11,50.04 134.11,52.07 135.89,53.85 135.89,75.95 v137.16,77.22
  Bottom 0.152: JP-BOOT1.1 137.34,77.39 v137.16,77.22
DISC
  Top 0.203: UC1.P$53 129.77,91.23 R74.1
  Top 0.254: R74.1 128.78,92.19
GND  (via drill 0.38, 0.6, 0.9)
  Top 0.152: v133.1,27.43 C91.+ | v143.26,27.43 C92.+ | v138.18,27.43 C93.+ | UC1.P$63 124.77,51.51 v124.21,52.07 | UC1.P$47 132.79,47.45 v132.59,47.24 | UC1.P$18 124.77,39.68 v124.97,39.88 | C96.1 v135.13,51.82 | R105.1 147.83,50.75 v149.12,50.75 | R104.1 147.83,53.29 v149.12,53.29 | R103.1 148.99,60.85 v149.1,60.96 | R85.2 v145.8,90.17 | v143.26,70.87 144.41,70.87 R93.2
  Top 0.203: U9.4 v20.68,18.16 | v25.02,12.09 R98.+ C103.+ | v119.63,48.01 119.63,49.16 C2.1 | C4.1 133.71,37.31 v132.54,37.31 131.47,37.31 131.27,37.52 UC1.P$31 | C3.1 123.83,35.83 v123.83,34.8
  Top 0.254: UC1.P$12 123.42,42.45 v123.44,42.42 | C1.1 v117.09,41.91 | v115.57,40.13 C89.- | C101.- v104.9,39.88 | C94.- v104.9,42.67 | 137.92,108.71 SERIAL.1 | 140.46,108.71 SERIAL.2 | C83.1 v111.76,49.53 | C82.1 v114.88,50.39 | R84.1 v142.24,81.79
  Top 0.305: C95.- v84.58,11.43 | R77.1 v121.54,106.81 | C80.1 v129.16,106.81 | C79.1 v134.87,106.81 | Q3.2 127.51,98.41 v127.51,97.28 127.51,96.03 R71.1 | C104.- v28.45,28.45 | v95.25,11.43 C102.-
  Top 0.406: C26.- v44.2,89.92 | C6.- v18.8,89.92 | C31.- 50.55,75.95 v50.55,73.41 | C13.- 25.15,75.95 v25.15,73.41 | C23.P$2 v31.5,86.11 | C7.P$2 v6.1,86.11 | v35.31,68.33 C44.- | v9.91,68.33 C45.- | C14.- 22.43,78.49 U1.11 | C32.- 47.83,78.49 U2.11 | C42.+ 34.04,74.86 v34.04,74.68 | C41.+ 8.64,74.86 v8.64,74.68 | C29.- v42.93,69.6 | C11.- v17.53,69.6 | C36.- v31.5,53.09 | C18.- v6.1,53.09 | C43.+ v6.1,50.55 | C21.- v6.1,48.01 | C20.- v7.37,36.58 | C98.+ v31.5,50.55 | C39.- v31.5,48.01 | U3.11 C77.- | C35.- 32.59,63.25 v30.99,63.25 | C17.- 7.19,63.25 v5.59,63.25 | C38.- v32.77,36.58 | R3.2 v26.42,56.9 | C60.+ 92.46,72.14 v92.46,69.6 | C107.- 97.54,72.14 v97.54,69.6 | v89.92,68.33 C74.- | C46.+ 92.46,45.29 v92.46,42.93 | C108.- 97.54,45.29 v97.54,42.93 | C84.- v89.92,41.66 | v86.11,87.38 C61.- | C63.- 99.9,87.2 v100.08,87.38 | v86.11,60.71 C47.- | C49.- 97.72,60.71 v100.08,60.71 | U8.11 73.41,84.66 C65.- | U7.11 73.41,57.99 C51.- | C64.- v72.14,87.38 | C50.- v72.14,60.71 | v75.95,68.33 C68.- | C67.- v82.3,64.52 | C54.- v75.95,41.66 | C53.- v82.3,37.85 | v73.41,68.33 C73.+ | C59.+ v73.41,41.66 | C56.- 60.71,43.1 v60.71,45.47 | C57.- v70.87,41.66 | v70.87,68.33 C71.- | C70.- 60.71,69.78 v60.71,72.14 | v31.5,14.73 R94.- | IC5.1 79.06,101.65 C81.1 v77.47,101.6 | C85.1 v82.55,102.11 | v121.41,88.14 C87.1 | v121.92,86.36 122.04,86.36 C86.1 123.05,88.87 IC2.1 | R102.1 v152.4,106.68 | C15.- v24.64,92.46 | C33.- v50.04,92.46 | R81.1 v116.84,102.11 | v100.33,108.2 C106.1 | SD.P$12 116.18,118.62 v118.11,118.62 | SD.P$6 112.78,115.27 v112.78,113.79 | SD.P$11 106.93,104.77 v106.93,102.87 | v140.46,107.37 140.46,108.71 | v137.92,107.44 137.92,108.71 | v154.69,19.05 C110.-
  Top 0.61: C109.+ v45.47,36.58 | C78.+ v20.07,36.58
  Top 0.813: v74.93,96.52 C88.- | v87.88,96.27 C105.- | C99.- v119.13,101.35 | v123.95,76.96 C90.-
  pour Route2: 1.02,119.13 159.77,119.13 159.77,1.02 1.02,1.02
JTCK  (via drill 0.38)
  Top 0.152: 147.83,61.98 R109.1 147.94,61.98 J.9 | UC1.P$49 131.77,61.98 v132.08,61.98
  Bottom 0.152: v132.08,61.98 J.9
JTDI  (via drill 0.38)
  Top 0.152: R107.1 147.83,67.06 J.5 | UC1.P$50 131.27,67.06 v131.32,67.06
  Bottom 0.152: v131.32,67.06 J.5
JTDO  (via drill 0.38)
  Top 0.152: R110.1 147.83,56.9 J.13 | UC1.P$55 128.77,56.9 v129.03,56.9
  Bottom 0.152: v129.03,56.9 J.13
JTMS  (via drill 0.38)
  Top 0.152: R108.1 147.83,64.52 J.7 | UC1.P$46 136.1,46.95 137.41,48.26 137.41,64.01 v136.91,64.52
  Bottom 0.152: v136.91,64.52 J.7
JTRST  (via drill 0.38)
  Top 0.152: UC1.P$56 v128.27,69.6 | R106.1 147.83,69.6 J.3 | 147.57,69.6 147.57,69.71 R106.1 | 147.57,69.6 147.72,69.6 R106.1 | 147.57,69.6 146.75,69.6 JP-JTRST.1
  Bottom 0.152: v128.27,69.6 J.3
N$1
  Top 0.152: UC1.P$5 121.35,45.95 arc-23 120.67,46.09 arc-42 118.24,48.45 arc72 OSC.3 117.42,50.51
  Top 0.203: OSC.3 117.72,48.9 | 117.42,50.28 C82.2 117.42,50.51
N$2
  Top 0.406: R5.2 9.91,92.46 10.09,92.28 C5.-
N$3
  Top 0.406: C6.+ 15.16,82.47 13.72,81.03 U1.3 | C6.+ C5.+ | R6.1 14.99,92.46 15.16,92.28 C6.+
N$4
  Top 0.406: C7.P$1 6.1,81.03 9.59,81.03 R7.1
N$5
  Top 0.406: JP6.2 39.12,114.68 23.24,98.81 18.48,98.81 R5.1
N$6
  Bottom 0.406: PHONO-IN.P$2 17.91,113.41 32.13,113.41 JP6.1
N$7
  Top 0.152: C83.2 111.87,46.99 113.28,46.99 113.67,46.6 OSC.1 | UC1.P$6 121.34,45.44 arc-20 120.97,45.5 arc17 119.88,45.72 arc2 119.43,45.73 arc2 119.19,45.73 arc-2 115.98,45.73 arc-37 114.55,46.23
  Top 0.203: 114.55,46.23 114.09,46.23 OSC.1
N$8
  Top 0.406: U1.2 9.91,83.57 | 9.91,83.57 R7.2 | 9.91,83.57 C8.-
  Bottom 0.406: GAIN.P$5 11.99,20.78 3.99,28.78 3.99,59.16 7.26,62.43 7.26,69.65 9.88,72.26 9.88,82.58 10.87,83.57 U1.2
N$9
  Top 0.406: R8.1 4.83,68.33 5,68.15 C10.+
N$10
  Top 0.406: C10.- 5.66,64.26 4.57,64.26 3.17,62.87 3.17,13.34 6.99,9.53 15.88,9.53 24.13,1.27 43.26,1.27 FEEDBACK.P$6
N$11
  Top 0.406: R9.1 4.83,70.87 5,71.05 C9.+
N$12
  Top 0.406: R8.2 7.37,68.33 7.05,68.65 R9.2 8.64,70.87 9.91,72.14 | U1.5 9.91,73.41 9.91,72.14 | 9.91,72.14 C45.+
N$13
  Top 0.305: 127.27,104.25 R1.2 128.66,102.84 131.47,102.84 131.95,102.36 131.95,99.04 Q2.2
N$14
  Top 0.406: U1.6 U1.7 R10.1
N$15
  Top 0.406: R12.1 20.07,65.79 14.99,65.79 | 12.77,65.79 R10.2 | 12.77,65.79 14.99,65.79 | 14.99,65.79 R11.1 14.67,65.79 12.77,65.79 | C11.+ 17.35,65.79 14.99,65.79 | 12.45,65.79 12.77,65.79
N$16
  Top 0.305: R71.2 128.79,97.78 Q2.1 129.73,98.87 128.14,100.46 127.34,100.46 Q3.3 126.87,102.73 R72.1
N$17
  Top 0.406: C12.- 22.61,73.41 U1.9 17.53,73.41 14.99,70.87 R11.2
N$18
  Top 0.406: R13.1 26.42,77.54 26.42,72.14 25.32,71.05 C12.+ 22.61,70.87 U1.8 R12.2
N$19
  Top 0.406: 25.15,82.3 R13.2 | 25.15,82.3 R14.1 | 25.15,82.3 22.93,82.3 R15.1 C14.+
N$20
  Top 0.406: R15.2 22.61,84.84 21.34,83.57 U1.13 18.8,83.57 18.03,84.33 18.03,87.12 19.3,88.39 C16.-
N$21
  Top 0.406: 23.56,86.11 R14.2 25.15,84.84 26.42,84.84 27.69,83.57 27.69,70.87 20.07,63.25 R16.1 | 23.56,86.11 U1.14 | 23.56,86.11 22.93,86.11 C16.+
N$22  (via drill 0.6)
  Top 0.406: 26.42,50.73 C77.+ | R2.2 R3.1 26.42,50.73 | 26.42,50.73 v26.42,48.01 U3.10
  Bottom 0.406: v26.42,48.01 26.42,46.74 28.96,44.2 46.74,44.2 48.01,45.47 48.01,46.74 46.74,48.01 U4.10
N$23
  Top 0.406: R16.2 R18.1 7.37,60.71 | R17.1 7.37,60.71 | 7.37,60.71 C17.+
N$24
  Top 0.406: R80.2 100.33,116.87 SD.P$9
N$25
  Top 0.406: U3.2 9.91,55.63 C19.- 7.54,55.8 7.37,55.63 R17.2
N$26
  Top 0.406: R18.2 12.45,60.71 U3.1 | C19.+ 9.91,58.17 U3.1 | U3.1 13.72,58.17 14.99,56.9 14.99,40.71 R19.1
N$27
  Top 0.406: 7.37,40.39 9.91,40.39 | C20.+ 7.37,40.39 | 7.37,40.39 R20.1 | 9.91,40.39 R21.1 | R19.2 10.23,40.07 9.91,40.39
N$28
  Top 0.406: U3.6 9.91,45.47 C22.- 7.54,45.29 7.37,45.47 R20.2
N$30
  Top 0.406: R22.2 35.31,92.46 35.48,92.28 C25.-
N$31
  Top 0.406: U1.1 11.36,87.2 C8.+ 9.91,87.38 4.83,87.38 3.56,86.11 3.56,78.49 JP16.1 | GAIN.P$6 11.81,1.73 18.16,1.73 GAIN.P$1
  Bottom 0.406: MIX.P$5 28.5,2.29 21.34,2.29 20.07,3.56 GAIN.P$1 | GAIN.P$6 9.99,5.08 10.57,5.66 10.57,9.04 9.68,9.93 7.72,9.93 2.69,14.96 2.69,75.08 JP16.1
N$32
  Top 0.406: U2.3 39.12,81.03 40.56,82.47 C26.+ 40.39,89.92 | 40.39,89.92 C25.+ | R23.1 40.71,90.24 40.39,89.92
N$33
  Top 0.406: U2.1 36.76,87.2 C24.+ 35.31,87.38 30.23,87.38 28.96,86.11 28.96,78.31 JP15.1
  Bottom 0.406: 39.12,79.76 40.39,81.03 40.39,84.84 39.12,86.11 U2.1 | GAIN.P$3 GAIN.P$2 17.99,3.1 20.07,1.02 29.23,1.02 MIX.P$4 31.77,9.67 33.53,11.43 33.53,30.73 24.89,39.37 24.89,63.75 28.96,67.82 28.96,75.95 JP15.1
N$34
  Top 0.406: C23.P$1 31.5,81.03 34.99,81.03 R24.1
N$35
  Top 0.406: U2.2 35.31,83.57 | 35.31,83.57 R24.2 | 35.31,83.57 C24.-
  Bottom 0.406: 37.34,83.57 U2.2 | 37.34,83.57 36.58,83.57 | GAIN.P$4 15.01,4.58 15.01,26.16 23.34,34.49 23.34,65.94 27.25,69.85 27.25,79.2 31.62,83.57 37.34,83.57
N$36
  Top 0.305: Q3.1 125.92,95.06 126.87,94.11 R73.1 R74.2
N$37  (via drill 0.38)
  Top 0.406: v35.05,65.79 C28.-
  Bottom 0.406: FEEDBACK.P$3 51.55,55.39 45.97,60.96 39.88,60.96 v35.05,65.79
N$38
  Top 0.406: C28.+ 30.23,65.79 30.55,66.11 R25.1
N$39
  Top 0.406: R26.1 30.23,70.87 30.41,71.05 C27.+
N$40
  Top 0.406: R25.2 32.77,68.33 32.45,68.65 R26.2 34.04,70.87 35.31,72.14 | U2.5 35.31,73.41 35.31,72.14 | 35.31,72.14 C44.+
N$41
  Top 0.406: U2.6 U2.7 R27.1
N$42
  Top 0.406: R29.1 45.47,65.79 40.39,65.79 | 38.17,65.79 R27.2 | 38.17,65.79 40.39,65.79 | 40.39,65.79 R28.1 40.07,65.79 38.17,65.79 | C29.+ 42.75,65.79 40.39,65.79 | 37.85,65.79 38.17,65.79
N$43
  Top 0.406: C30.- 48.01,73.41 U2.9 42.93,73.41 40.39,70.87 R28.2
N$44
  Top 0.406: R30.1 51.82,77.54 51.82,72.14 50.73,71.05 C30.+ 48.01,70.87 U2.8 R29.2
N$45
  Top 0.406: 50.55,82.3 R30.2 | 50.55,82.3 R31.1 | 50.55,82.3 50.23,82.62 R32.1 C32.+
N$46
  Top 0.406: R32.2 47.69,84.52 46.74,83.57 U2.13 44.2,83.57 43.43,84.33 43.43,87.12 44.7,88.39 C34.-
N$47
  Top 0.406: 48.51,86.11 48.96,86.11 R31.2 50.55,84.84 51.82,84.84 53.09,83.57 53.09,70.87 45.47,63.25 R33.1 | 48.51,86.11 U2.14 | C34.+ 48.34,86.28 48.51,86.11
N$48
  Top 0.406: 35.31,60.71 R35.1 | R33.2 35.63,61.03 35.31,60.71 | 35.31,60.71 32.77,60.71 C35.+ R34.1
N$49
  Top 0.406: R34.2 32.77,55.63 32.95,55.8 C37.- 35.31,55.63 U4.2
N$50
  Top 0.406: R35.2 37.85,60.71 U4.1 | C37.+ 35.31,58.17 U4.1 | R36.1 40.39,40.71 40.39,56.9 39.12,58.17 U4.1
N$51
  Top 0.406: R36.2 35.31,37.85 arc90 35.63,38.17 R38.1 32.77,40.39 | C38.+ 32.77,40.39 | 32.77,40.39 R37.1
N$52
  Top 0.406: U4.6 35.31,45.47 C40.- 32.95,45.29 arc-90 32.77,45.47 R37.2
N$53
  Top 0.406: R39.2 U5.1
N$54
  Top 0.406: R40.2 U5.7
N$55
  Top 0.406: R40.1 102.62,40.39 R41.2
N$56
  Top 0.406: TRIMJUMP2.1 93.28,39.57 OTRIM2.P$3 88.65,40.39 87.38,41.66 R39.1 87.06,42.93 86.11,42.93 84.84,44.2 84.84,49.28 87.38,51.82 91.19,51.82 92.46,53.09 U5.12
N$57
  Top 0.406: D1.A 153.67,100.53 154.1,100.1 154.1,99.07 R100.2
N$58
  Top 0.406: U5.13 U5.14 87.38,57.85 R42.1
N$59
  Top 0.406: C47.+ 89.6,60.56 89.92,60.24 89.92,58.17 | 89.92,58.17 R43.1 R44.1 | R42.2 89.92,58.17
N$60
  Top 0.406: C48.- 100.08,58.17 U5.9 100.08,54.36 99.31,53.59 97.03,53.59 96.27,54.36 96.27,56.9 95,58.17 R43.2
N$61
  Top 0.406: 102.62,58.17 U5.8 | 102.62,58.17 102.62,60.71 101.35,61.98 95.95,61.98 R44.2 94.68,61.03 93.73,61.98 83.89,61.98 R45.1 | 102.62,58.17 C48.+
N$62
  Top 0.406: R45.2 83.12,60.2 81.53,60.2 81.35,60.39 R46.1 R47.1 78.17,60.71 C50.+
N$63
  Top 0.406: R47.2 U7.9 78.49,54.36 79.76,53.09 83.39,53.09 C52.-
N$64
  Top 0.406: R46.2 U7.8 83.39,55.63 C52.+ 83.75,55.45 84.84,54.36 84.84,51.82 83.57,50.55 R48.1
N$65
  Top 0.406: R48.2 R50.1 R49.1 78.49,38.02 C53.+
N$66
  Top 0.406: U7.6 78.49,45.65 C55.- 78.49,45.29 R49.2
N$67
  Top 0.406: R50.2 81.03,45.29 C55.+ 81.03,45.65 U7.7 81.03,49.28 79.76,50.55 64.52,50.55 63.25,49.28 R51.1
N$68
  Top 0.406: R51.2 63.25,43.1 C56.+ 63.25,42.75 63.25,41.66 64.2,40.71 R53.1 R52.1
N$69
  Top 0.406: R52.2 68.33,45.29 C58.- 68.33,45.65 U7.2
N$70
  Top 0.406: R55.2 U6.7
N$71
  Top 0.406: R56.2 102.62,67.06 R55.1
N$72
  Top 0.406: TRIMJUMP1.1 93.28,66.24 OTRIM1.P$3 88.65,67.06 87.38,68.33 R54.1 87.06,69.6 86.11,69.6 84.84,70.87 84.84,75.95 87.38,78.49 91.19,78.49 92.46,79.76 U6.12
N$73
  Top 0.406: U6.13 U6.14 87.38,84.84 R57.1
N$74
  Top 0.406: R59.1 R58.1 R57.2 89.92,85.16 89.92,87.38 C61.+
N$75
  Top 0.406: C62.- 100.08,84.66 U6.9 100.08,81.03 98.81,79.76 97.54,79.76 96.27,81.03 96.27,83.57 95,84.84 R58.2
N$76
  Top 0.406: U6.8 102.62,84.66 C62.+ 102.62,84.84 102.62,87.38 101.35,88.65 95.95,88.65 R59.2 94.68,87.7 93.73,88.65 83.89,88.65 R60.1
N$77
  Top 0.406: R60.2 83.12,86.87 81.53,86.87 81.35,87.06 R61.1 R62.1 78.17,87.38 C64.+
N$78
  Top 0.406: R62.2 U8.9 78.49,81.03 79.76,79.76 83.39,79.76 C66.-
N$79
  Top 0.406: R61.2 U8.8 83.39,82.3 C66.+ 83.75,82.3 83.75,82.12 84.84,81.03 84.84,78.49 83.57,77.22 R63.1
N$80
  Top 0.406: R63.2 R65.1 R64.1 78.49,64.69 C67.+
N$81
  Top 0.406: U8.6 78.49,72.31 C69.- 78.49,71.96 R64.2
N$82
  Top 0.254: 81.03,72.14 C69.+
  Top 0.406: 81.03,72.14 U8.7 81.03,75.95 79.76,77.22 64.52,77.22 63.25,75.95 R66.1 | R65.2 81.03,71.96 C69.+
N$83
  Top 0.406: R66.2 63.25,69.6 C70.+ 63.25,69.42 63.25,68.33 64.2,67.38 R68.1 R67.1
N$84
  Top 0.406: U8.2 68.33,72.31 C72.- 68.33,72.14 R67.2
N$85  (via drill 0.38)
  Top 0.406: MIX.P$6 42.24,18.03 v55.37,18.03 | v55.37,52.58 69.34,52.58 70.87,54.1 U7.12
  Bottom 0.406: v55.37,18.03 v55.37,52.58
N$86
  Top 0.406: R69.1 70.87,115.32 JP3.1
N$87
  Top 0.406: 65.61,85.93 C75.+ JP17.2 U8.13 U8.14
N$88  (via drill 0.38)
  Top 0.406: v72.9,37.08 v61.72,37.08 | v61.72,59.44 C76.-
  Bottom 0.406: LEVEL.P$1 73.33,5.41 72.9,5.84 v72.9,37.08 | v61.72,37.08 v61.72,59.44
N$89  (via drill 0.38)
  Top 0.406: v71.37,34.8 v58.42,34.8 | v58.42,86.11 C75.-
  Bottom 0.406: LEVEL.P$2 71.33,34.04 v71.37,34.8 | v58.42,34.8 v58.42,86.11
N$90  (via drill 0.38)
  Top 0.406: MIX.P$3 33.77,6.84 42.67,15.75 v56.9,15.75 | v56.9,79.76 69.85,79.76 70.87,80.77 U8.12
  Bottom 0.406: v56.9,15.75 v56.9,79.76
N$91
  Top 0.254: X1.D- 130.48,109.02 132.97,106.53 R75.2
N$92  (via drill 0.38)
  Top 0.406: v69.34,29.21 v49.28,29.21 | v49.28,55.37 49.28,56.9 v51.05,58.67 | v70.87,109.73 R69.2
  Bottom 0.406: LEVEL.P$3 69.33,29.21 v69.34,29.21 | v49.28,29.21 v49.28,55.37 | v51.05,58.67 51.82,59.44 51.82,92.46 65.79,106.43 67.56,106.43 v70.87,109.73
N$93  (via drill 0.38)
  Top 0.406: v67.31,24.89 v53.59,24.89 | v78.49,109.73 R70.2
  Bottom 0.406: LEVEL.P$6 63.33,5.16 67.31,9.14 v67.31,24.89 | v53.59,24.89 53.59,84.84 v78.49,109.73
N$94
  Bottom 0.406: JP4.2 71.12,113.03 53.09,113.03 PHONO-OUT.P$2
N$96
  Top 0.254: X1.D+ 127,109.75 127,108.37 127.66,107.71 130.24,107.71 131.06,106.88 R76.2
N$97
  Top 0.813: EXT-BAR.PWR 89.05,107.81 D2.A 93.73,113.54 EXT.2
N$108
  Top 0.152: R85.1 148.12,90.19 RESET.2 RESET.1
N$109
  Top 0.254: 154.18,81.31 BUT.2 | 154.18,81.31 BUT.1 | 147.97,81.15 R86.2 154.18,81.31
N$110  (via drill 0.38)
  Top 0.152: UC1.P$60 126.27,51.31 127.51,52.58 v127.51,78.99
  Bottom 0.152: JP-BOOT0.2 144.53,80.01 143.51,78.99 v127.51,78.99
N$113
  Top 0.203: 31.5,19.43 U9.6 25.78,19.43 24.51,20.7 U9.2 | 31.5,19.43 D7.P$1 | 31.5,19.43 R94.+
  Top 0.406: D7.P$1 D6.P$1
N$114
  Top 0.152: C97.2 147.57,102.36 150.62,105.41 SERIAL.6
N$115
  Top 0.152: R88.+ R90.+ 135.31,25.91 135.13,25.91 127.51,18.29 116.08,18.29 JP-KNOB.7
  Top 0.254: MOD3.P$3 117.86,3.72 117.86,7.37 112.78,12.45 112.78,14.99 JP-KNOB.7
N$116  (via drill 0.38)
  Top 0.203: R99.+ v18.8,16.23 | v21.23,16.23 24.76,16.23 arc-90 R98.-
  Top 0.305: R98.- C103.- 27.61,16.26 28.19,16.26 28.19,18.16 U9.5
  Bottom 0.203: v18.8,16.23 v21.23,16.23
N$117  (via drill 0.38)
  Top 0.203: v19.86,21.36 20.47,21.97 U9.1 22.28,23.39 23.16,24.28 23.16,24.44 C100.- | v17.73,21.36 14.83,21.36 12.01,18.54 12.01,15.82 RED.K
  Bottom 0.203: v17.73,21.36 v19.86,21.36
N$118  (via drill 0.38)
  Top 0.203: v26.24,20.7 U9.7 | v24.66,19.13 24.66,18.77 23.29,17.4 21.16,17.4 17.48,13.72 YELLOW.K
  Bottom 0.203: v24.66,19.13 v26.24,20.7
N$119
  Top 0.203: R95.+ 7.54,13.89 RED.A
N$120
  Top 0.203: R96.+ 13.89,13.89 YELLOW.A
N$121
  Top 0.406: IC5.2 80.96,101.65 C81.2 82.41,100.1 C88.+
  Top 0.813: C88.+ 83.82,96.52 85.09,95.25 85.09,93.8 JP-VDDA.2
N$122
  Top 0.203: U9.3 19.25,19.43 R99.- R97.+ 21.36,22.79 C100.+
N$124
  Top 0.406: R56.1 OTRIM1.P$1 OTRIM1.P$2 94.18,66.24 TRIMJUMP1.2
N$125
  Top 0.152: R93.1 JP-BOOT1.2
N$126
  Top 0.406: R41.1 OTRIM2.P$1 OTRIM2.P$2 94.18,39.57 TRIMJUMP2.2
N$127
  Top 0.406: R54.2 U6.1
N$129
  Top 0.406: 65.61,59.26 C76.+ JP14.2 U7.13 U7.14
N$130
  Top 0.406: PHONO-OUT.P$3 56.52,103.5 JP3.2
N$131
  Top 0.406: R70.1 JP4.1
N$132
  Top 0.152: R89.+ R91.+ 141.04,25.91 141.22,25.91 143.26,23.88 143.26,15.49 148.84,9.91 148.84,7.62 143.64,2.41 MOD3.P$2
  Top 0.254: MOD3.P$2 114.05,12.53 JP-KNOB.8
N$133
  Bottom 0.406: PHONO-IN.P$3 22.99,112.14 35.94,112.14 JP5.1
N$134
  Top 0.406: JP5.2 44.2,107.06 37.53,100.39 R22.1
N$135
  Top 0.406: C27.- 32.59,77.04 JP15.2
N$136
  Top 0.406: C9.- 7.19,77.04 JP16.2
N$137
  Top 0.406: R102.2 155.79,107.73 156.21,108.15 D13.K
N$140
  Top 0.152: J.11 147.94,59.44 R103.2
N$141
  Top 0.152: R104.2 147.83,51.82 J.17
N$142
  Top 0.152: R105.2 147.83,49.28 J.19
N$146  (via drill 0.38)
  Top 0.152: R101.- R92.+ 129.47,29.14 v120.9,20.57
  Top 0.254: MOD3.P$5 116.59,12.49 JP-KNOB.6
  Bottom 0.152: v120.9,20.57 117.86,17.53 117.86,14.99 JP-KNOB.6
PWMOUT1  (via drill 0.38)
  Top 0.406: U8.1 65.79,72.31 C72.+ 65.79,71.96 R68.2 | v56.13,1.27 54.61,1.27 53.59,2.29 53.59,3.51 FEEDBACK.P$2 53.55,9.6 v63.25,19.3
  Bottom 0.406: MIX.P$2 35.81,3.56 38.86,0.51 55.37,0.51 v56.13,1.27 | v63.25,19.3 63.25,72.14 U8.1
PWMOUT2  (via drill 0.38)
  Top 0.406: U7.1 65.79,45.65 C58.+ 65.79,45.29 R53.2 | FEEDBACK.P$1 55.55,4.91 55.12,5.33 55.12,9.14 60.45,14.48 v65.79,14.48
  Bottom 0.406: MIX.P$1 39.54,1.78 53.77,1.78 FEEDBACK.P$1 | v65.79,14.48 U7.1
RESET  (via drill 0.38)
  Top 0.152: UC1.P$7 128.26,44.95 132.33,49.02 132.33,54.1 v132.59,54.36 | J.15 149.1,54.36 146.81,56.64 146.81,66.55 145.54,67.82 145.54,69.28 JP-JTRST.2 145.54,69.4 145.54,70.61 146.81,71.88 v146.81,84.84 | v146.81,86.87 144.78,88.9 144.78,90.68 146.3,92.2 147.46,92.2 C97.1 154.26,92.31 RESET.3 154.61,96.77 R4.2
  Bottom 0.152: v132.59,54.36 J.15 | v146.81,84.84 v146.81,86.87
USB+
  Top 0.203: UC1.P$45 136.62,46.45 138.18,48.01 138.18,97.24 131.17,104.25 R76.1
  Top 0.305: R76.1 C80.2 R1.1
USB-
  Top 0.203: UC1.P$44 137.39,45.95 138.94,47.5 138.94,97.59 132.97,103.56 R75.1 132.97,104.27 133.1,104.14
  Top 0.305: R75.1 C79.2
USB_P  (via drill 0.38)
  Top 0.203: UC1.P$52 v130.27,92.73 v130.26,92.73 | v126.14,92.73 125.26,93.61 125.26,96.94 124.6,97.6 124.6,103.1 R78.1
  Top 0.254: R78.1 R77.2
  Bottom 0.203: v130.26,92.73 v126.14,92.73
VCC  (via drill 0.38, 0.9)
  Top 0.152: v130.56,22.61 R101.+ | v140.72,22.61 R91.- | UC1.P$48 134.81,47.95 v135.13,48.26 C96.2 | UC1.P$64 124.27,51.21 v123.32,51.21 | R106.2 148.73,71.01 v149.1,71.12 | R107.2 148.99,68.47 v149.1,68.58 | R108.2 148.99,65.93 v149.1,66.04 | R109.2 148.99,63.39 v149.1,63.5 | R110.2 148.99,58.31 v149.1,58.42 | v151.64,96.77 R4.1 | R73.2 129.67,94.11 v129.79,93.98 | Q2.3 130.68,101.22 | v135.64,22.61 R90.-
  Top 0.203: UC1.P$1 120.96,47.95 arc-90 v120.9,48.01 120.9,49.28 C2.2 | UC1.P$32 131.77,38.53 v132.54,38.53 133.71,38.53 C4.2 | UC1.P$19 125.27,37.08 v125.22,37.08 125.24,37.08 C3.2
  Top 0.254: R86.1 v148.08,78.87
  Top 0.305: v129.29,101.35 130.26,101.35 Q2.3
  Top 0.406: IC2.2 124.85,88.87 C86.2 | v143,107.31 SERIAL.3 | R80.1 C106.2 102.55,111.44 105.16,114.05 105.16,115.57 106.68,117.09 v110.49,117.09 110.49,115.36 SD.P$4 | v117.86,111.51 R79.1 | C110.+ JP-AIN1.6
  Top 0.66: 124.85,85.74 C86.2 | 124.85,85.74 123.95,84.84 C90.+ | v127,84.84 125.75,84.84 124.85,85.74
  pour Route15: 158.75,119.38 158.75,1.27 114.3,1.27 114.3,19.05 123.19,27.94 123.19,44.45 120.65,46.99 119.38,46.99 119.38,49.53 119.38,87.63 99.06,107.95 99.06,119.38
VCC/2  (via drill 0.38, 0.6)  (1 unrouted)
  Top 0.406: U1.10 C13.+ | U2.10 C31.+ | R23.2 v44.2,92.46 C33.+ | R6.2 v18.8,92.46 C15.+ | U4.3 C36.+ | U3.3 C18.+ | C21.+ U3.5 | C39.+ U4.5 | U5.2 C84.+ | U6.6 100.08,72.14 C107.+ | U6.2 C74.+ | C108.+ 100.08,45.65 U5.6 | U5.10 C49.+ | U8.10 75.95,84.66 C65.+ | U7.5 C54.+ | U7.10 75.95,57.99 C51.+ | U8.5 C68.+ | U7.3 C57.+ | U8.3 C71.+
  Top 0.61: U4.9 U4.8 | U4.8 C109.- | C78.- U3.8 U3.9 20.07,40.39 25.65,40.39 31.24,34.8 55.37,34.8 59.44,38.86 v72.14,38.86 | v42.16,59.69 v42.16,61.98 | v61.21,78.49 55.63,72.9 55.63,57.91 52.32,54.61 52.32,47.75 47.5,42.93 U4.8 | U6.10 C63.+ | U5.10 97.54,58.42
  Bottom 0.61: U3.9 17.53,45.47 14.99,48.01 | U3.5 14.99,48.01 | 13.46,53.09 13.72,53.09 14.99,51.82 14.99,48.01 | 13.46,53.09 U3.3 | U4.9 42.93,45.47 40.39,48.01 | U4.5 40.39,48.01 | 39.12,53.09 U4.3 | 39.12,53.09 40.39,51.82 40.39,48.01 | 39.12,53.09 42.16,56.13 v42.16,59.69 | v42.16,61.98 41.4,62.74 41.4,73.41 43.94,75.95 | 43.94,75.95 U2.10 | 43.94,75.95 42.67,77.22 42.67,80.01 43.69,81.03 U2.12 48.01,81.03 48.01,88.65 v44.2,92.46 | U6.6 100.08,75.95 97.54,78.49 | v61.21,78.49 70.87,78.49 | 70.87,78.49 73.41,78.49 | 73.41,78.49 89.66,78.49 | 89.66,78.49 97.54,78.49 | 97.54,78.49 U6.10 | U6.2 89.92,78.49 89.66,78.49 | U8.10 U8.5 75.95,78.49 73.41,78.49 | 70.87,78.49 U8.3 | 16.51,75.95 16.26,75.95 16.26,55.88 13.46,53.09 | 16.51,75.95 U1.10 | v18.8,92.46 23.11,88.14 23.11,82.3 21.84,81.03 U1.12 18.03,81.03 16.26,79.25 16.26,76.2 16.51,75.95 | v72.14,38.86 72.14,44.96 70.87,46.23 U7.3 70.87,51.82 75.95,51.82 | 75.95,51.82 U7.10 | 75.95,51.82 U7.5 | 75.95,51.82 89.92,51.82 | 89.92,51.82 97.79,51.82 | 97.79,51.82 100.08,51.82 U5.6 | U5.10 97.54,51.82 97.79,51.82 | 89.92,51.82 U5.2
VDD  (via drill 0.38)
  Top 0.203: R95.- 9.91,17.7 v9.91,19.3 | R96.- 16.26,17.7 v16.26,19.3 | U9.8 28.45,21.97 v28.45,22.86
  Top 0.254: UC1.P$13 120.69,41.95 v120.65,41.91 C1.2 119.52,40.45 C89.+ | C102.+ 100.74,10.21 100.74,4.04 101.62,3.15 102.95,3.15 104.48,4.68 MOD2.P$3
  Top 0.305: v28.45,22.86 C104.+ | v90.17,11.43 C95.+ | D8.P$1 v102.11,26.92 | D9.P$1 v102.11,38.1
  Top 0.406: C42.- 35.31,78.49 U2.4 | C41.- 9.91,78.49 U1.4 | C43.- U3.4 | C98.- U4.4 | U6.4 95,72.14 C60.- | U5.4 95,45.47 C46.- | C73.- U8.4 | C59.- U7.4 | R97.- v18.8,26.42
  Top 0.61: R2.1 23.69,55.31 v22.1,56.9
  Bottom 0.305: v90.17,11.43 89.88,11.43 MOD1.P$3
  pour Route15: 1.27,119.38 91.44,119.38 91.44,99.06 106.68,83.82 106.68,60.96 106.68,44.45 116.84,44.45 121.92,44.45 121.92,34.29 121.92,29.21 113.03,20.32 113.03,1.27 106.68,1.27 1.27,1.27
VIN  (via drill 0.38)
  Top 0.406: IC5.3 80.21,105.04 C85.2 82.69,104.9 87.63,104.9 88.14,104.39
  Top 0.66: 119.13,92.96 121.02,91.07 C87.2 123.9,91.07 IC2.3
  Top 0.813: C105.+ 88.14,104 88.14,104.39 88.14,104.65 90.42,104.65 91.56,103.51 D2.C D12.C 98.18,102.62 v100.08,102.62 | v117.09,92.96 119.13,92.96 C99.+
  Bottom 0.813: v100.08,102.62 104.39,102.62 114.05,92.96 v117.09,92.96

## Text on the board
tPlace: GND | 30 | 29 | 28 | 27 | VCC
_tsilk: 9VDC | 9VDC | + | - | pwr | In | gnd | 6-pin UART | Out | D1 | JP_VDDA | reset | BOOT0 | BOOT1 | but | jtag | GND | 0 | 1 | 3 | 2 | VDDA | LeafLabs | Maple Audio Processor | gain | mix | fb | mod1 | mod2 | mod3 | mode | level
_bsilk: joseph fourier, 1830. of ever honored memory